# EAGLE design TheRug-Andabil (EAGLE 7.7.0)
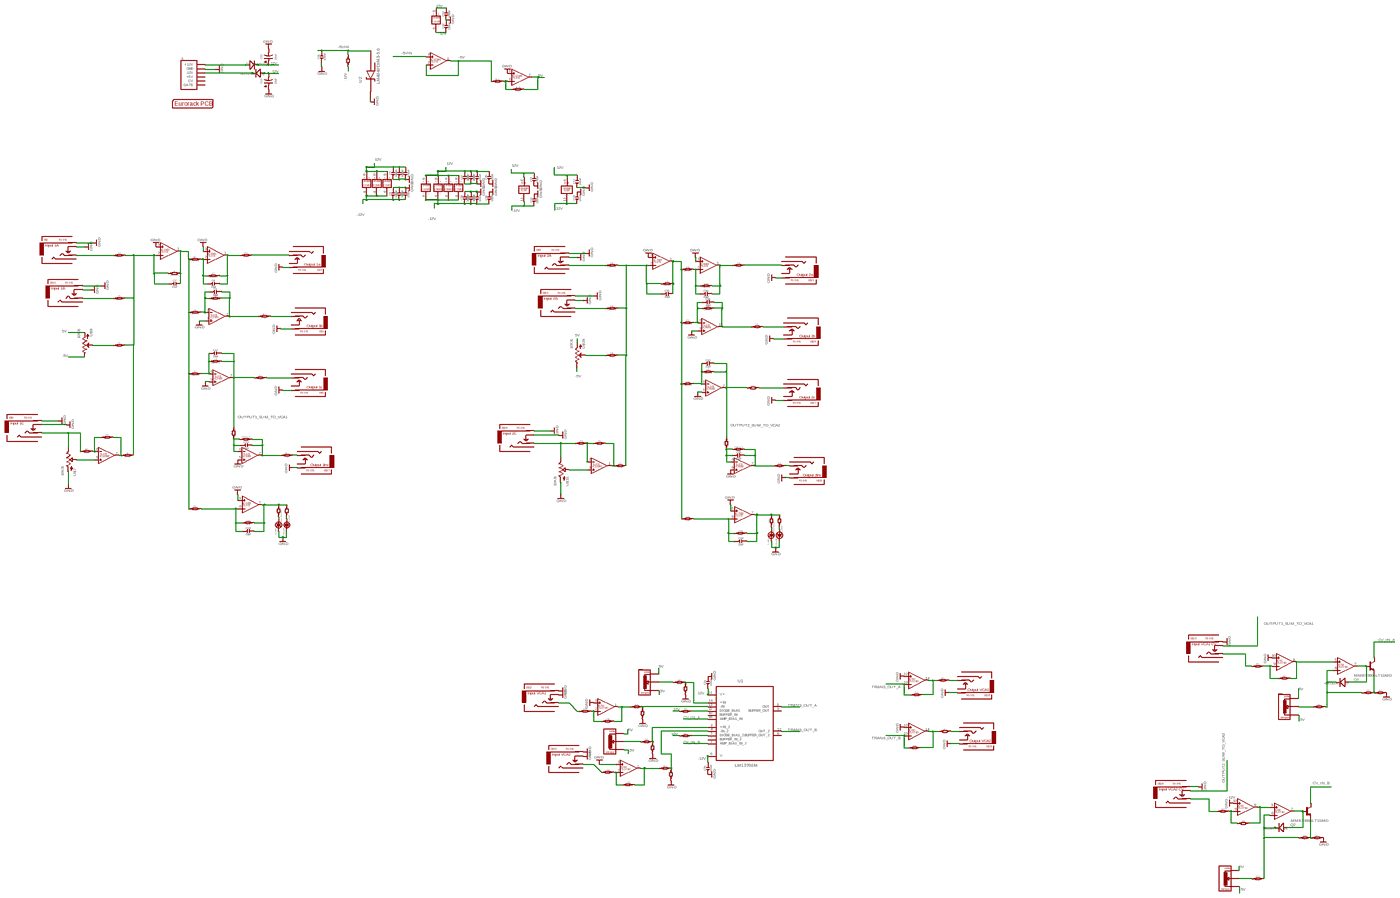
[diagram p0: schematic, sheet 1, overview]
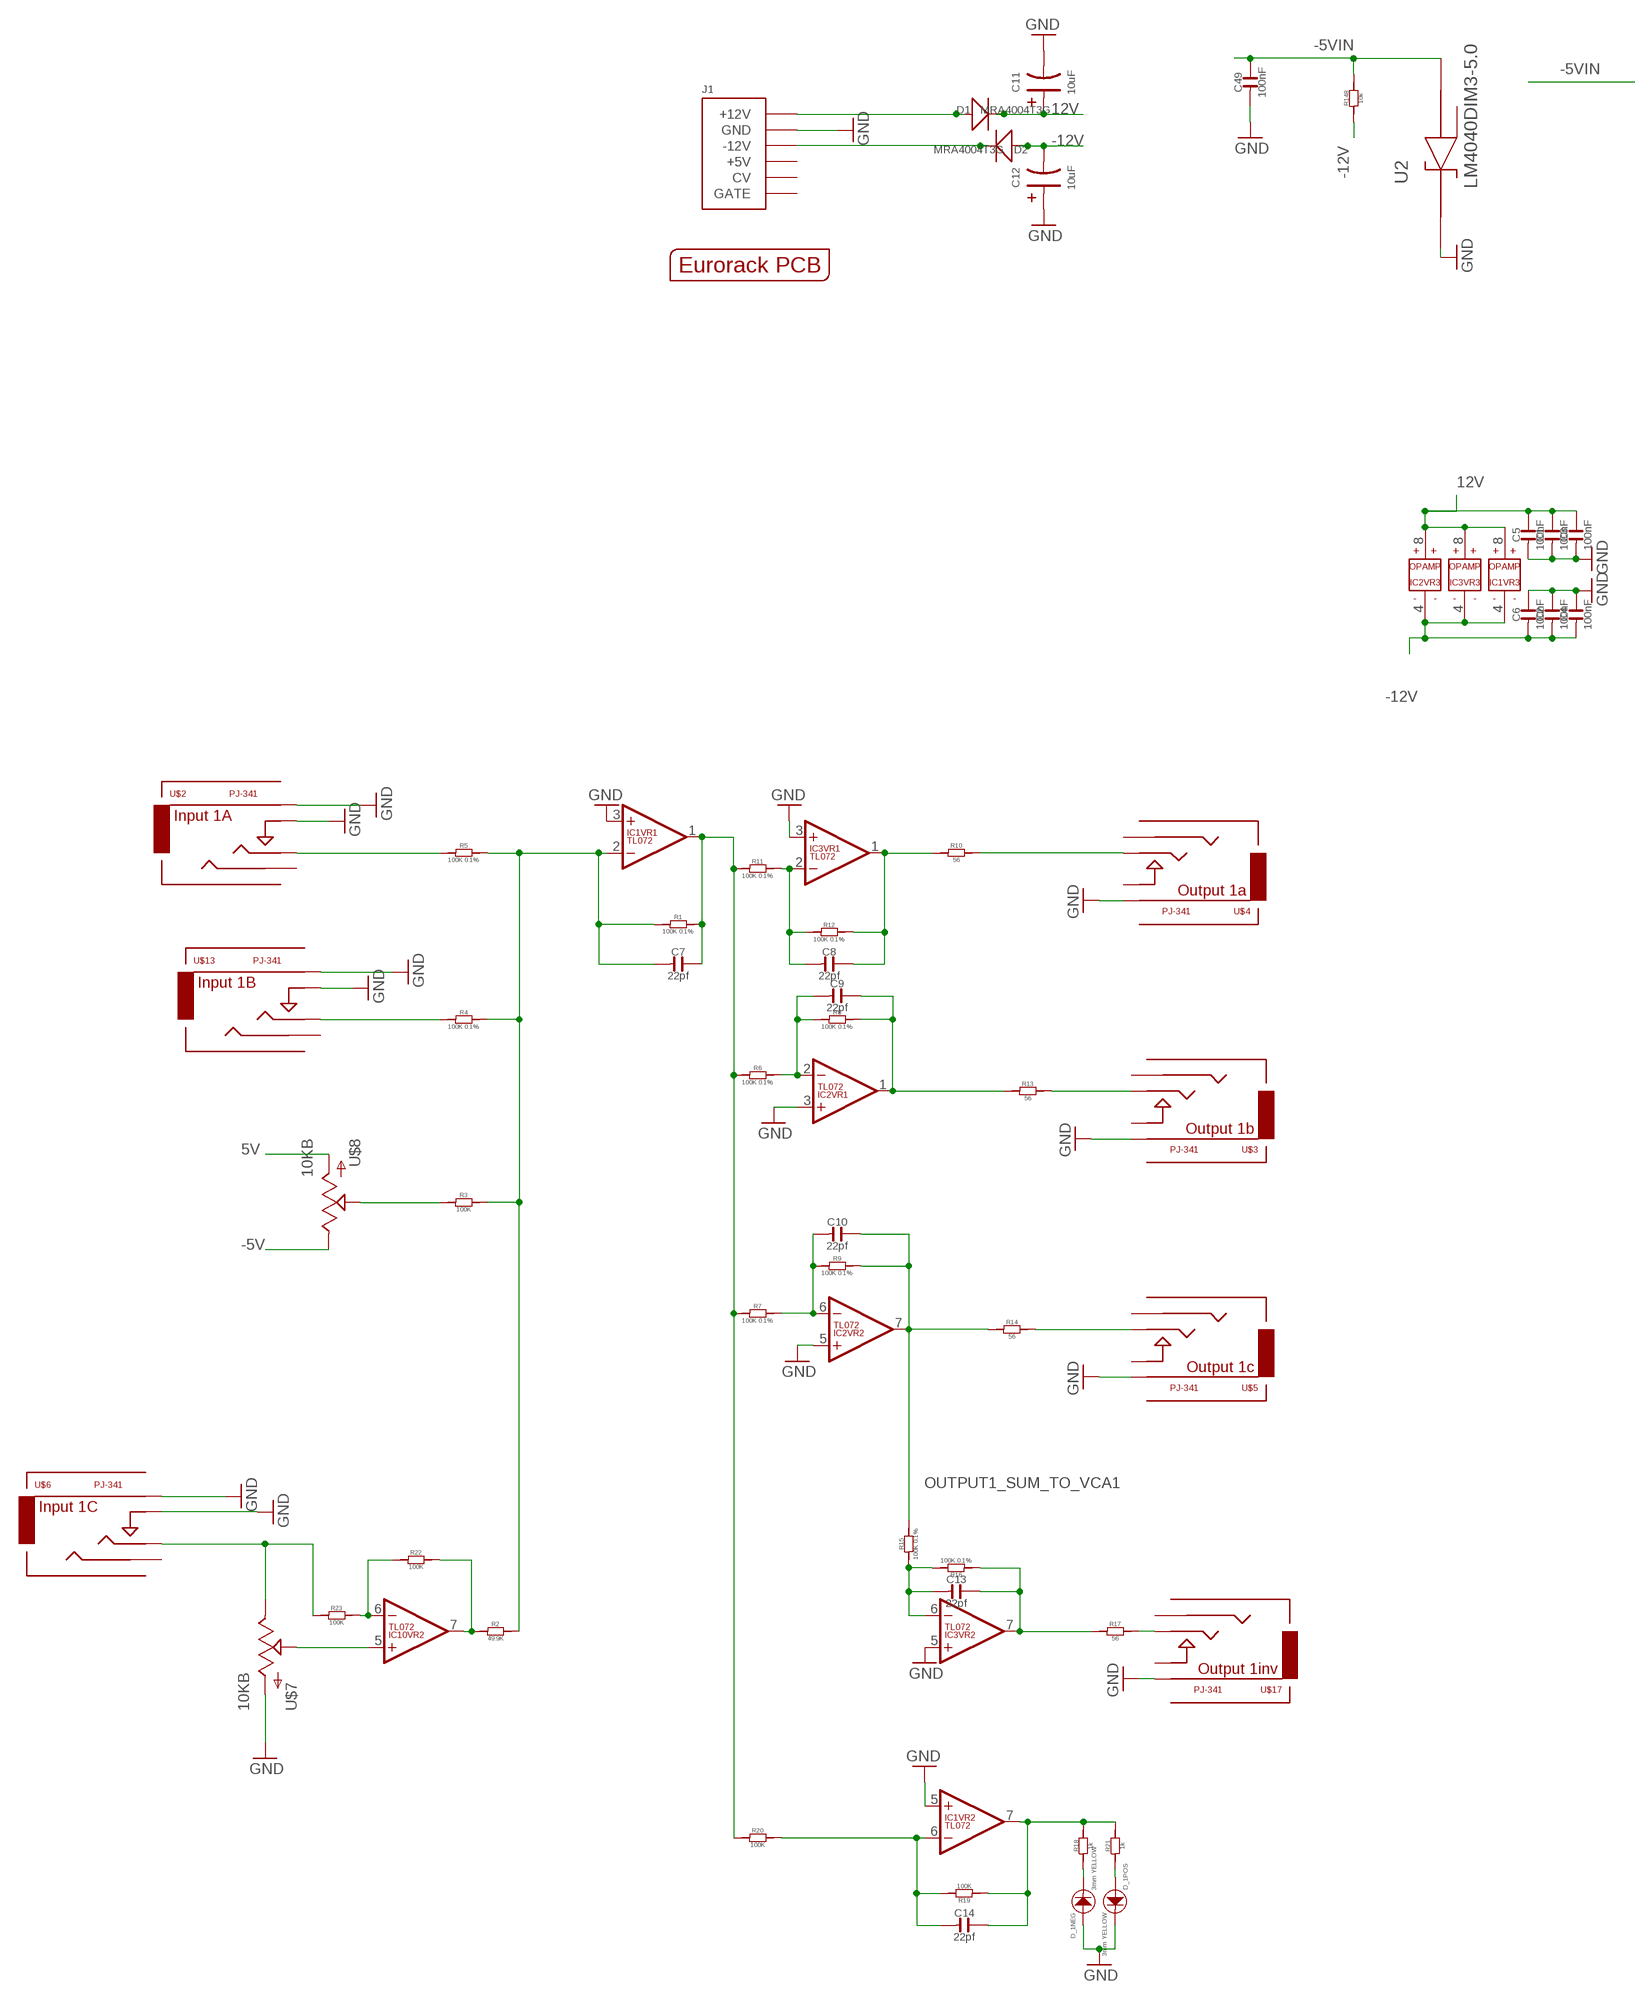
[diagram p1: schematic, sheet 1, part 1 of 4]
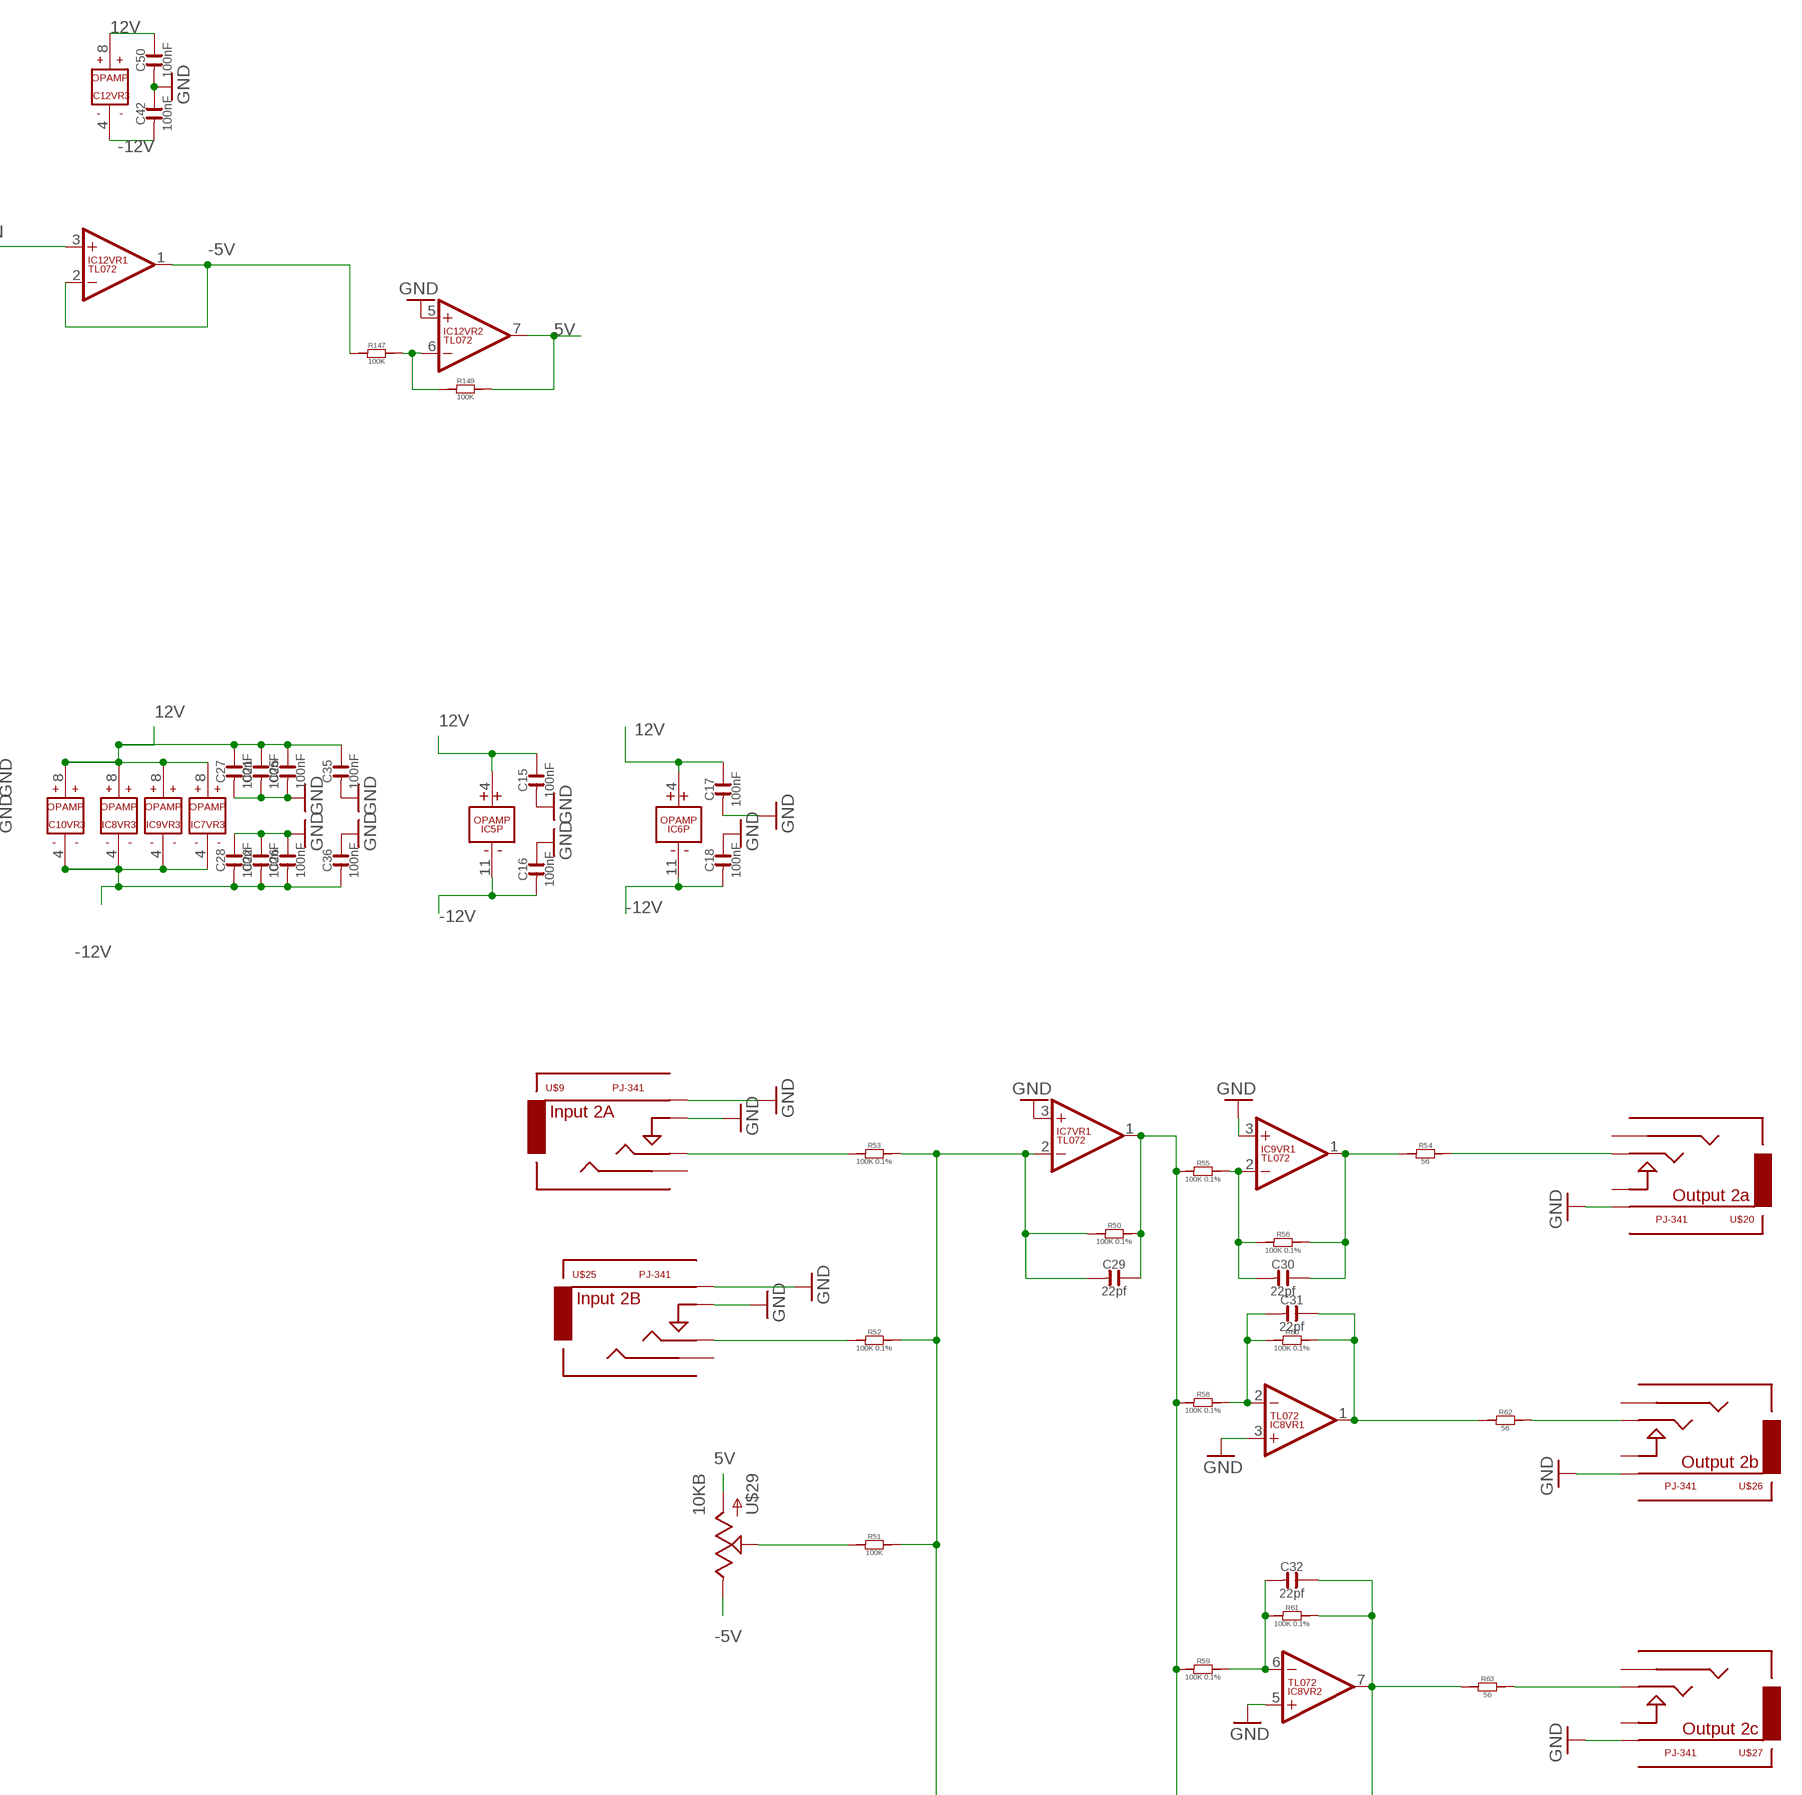
[diagram p2: schematic, sheet 1, part 2 of 4]
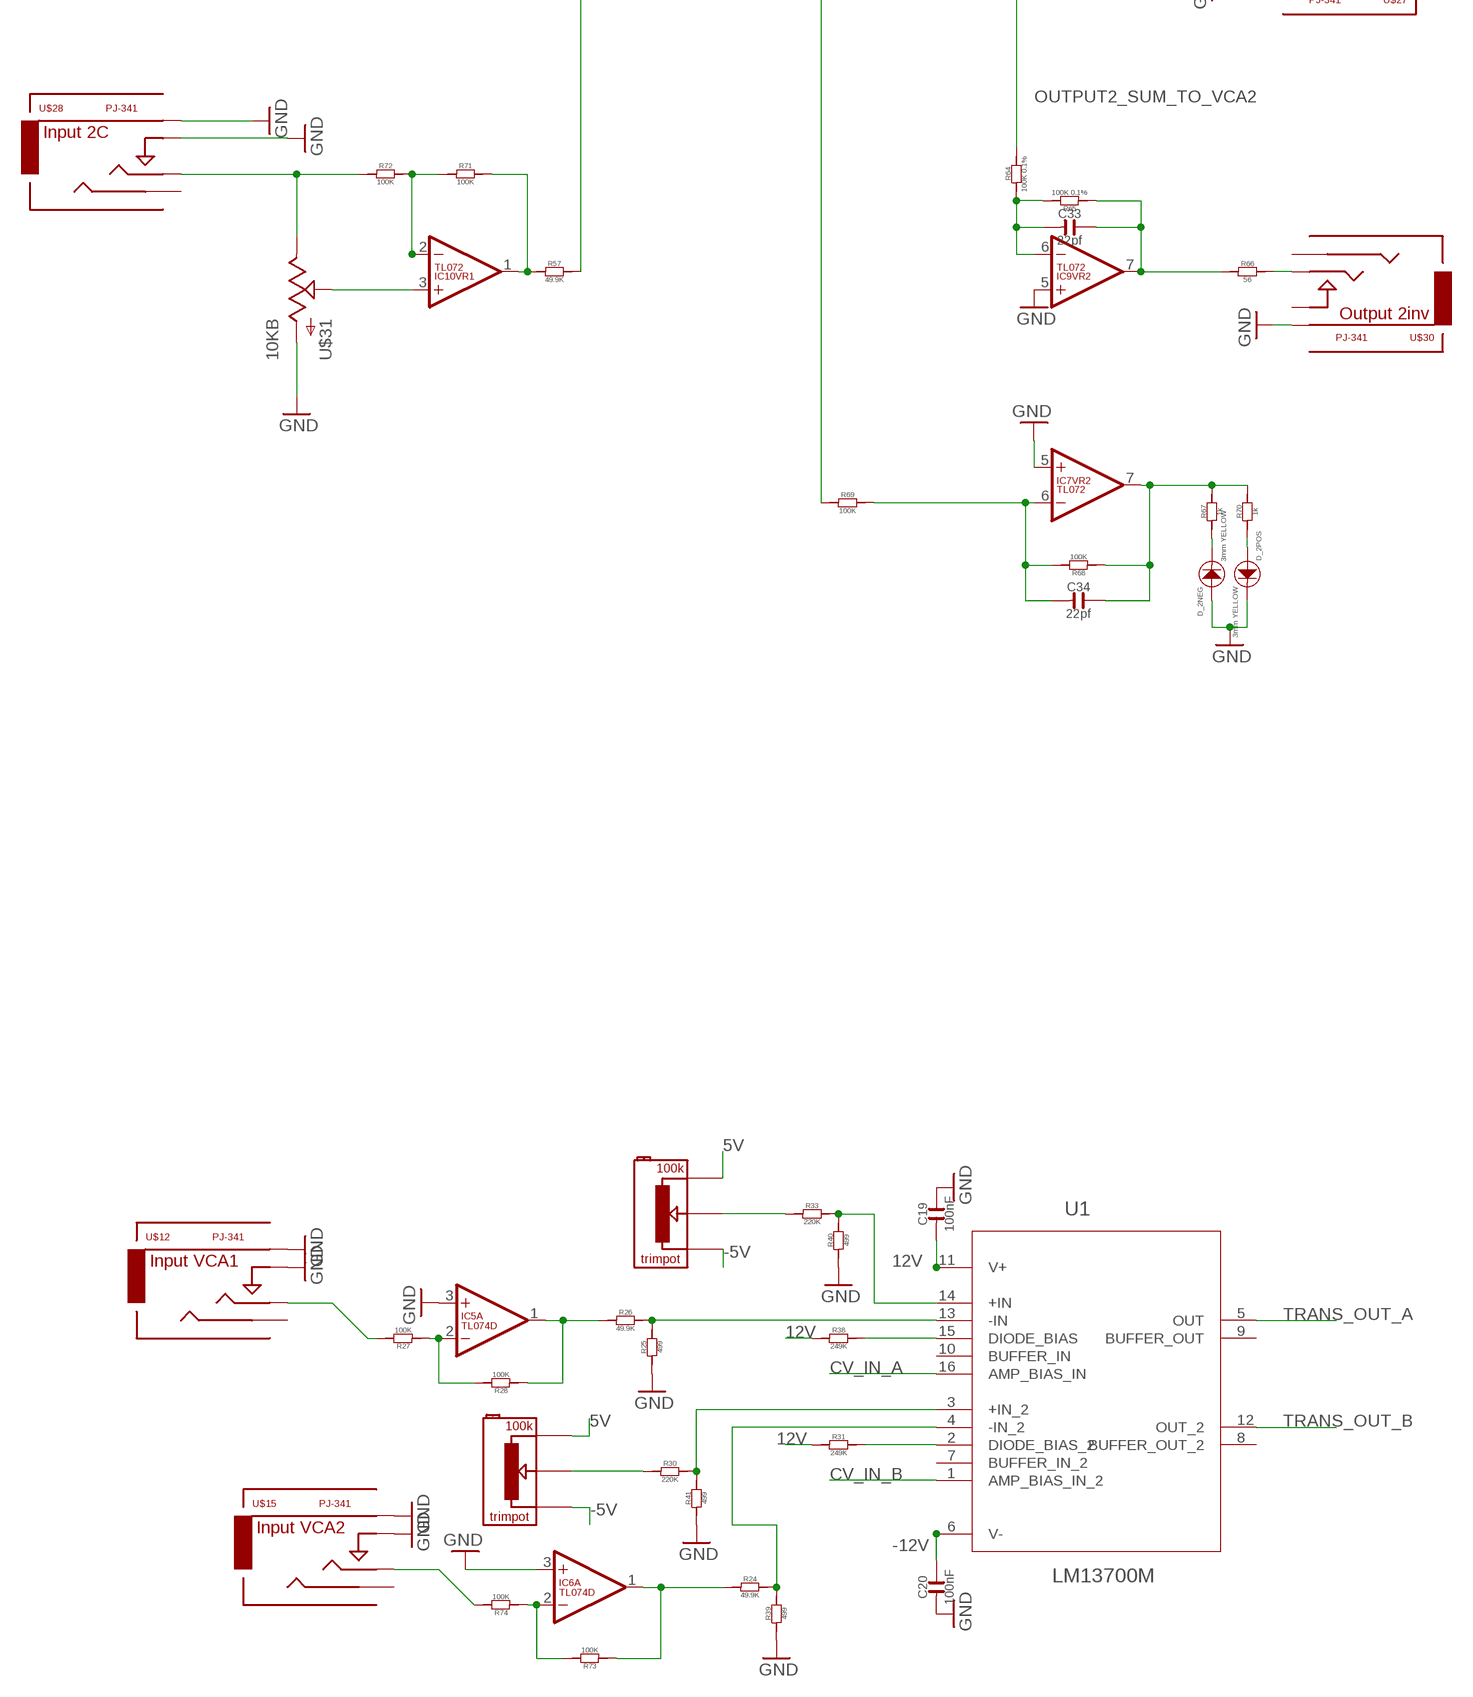
[diagram p3: schematic, sheet 1, part 3 of 4]
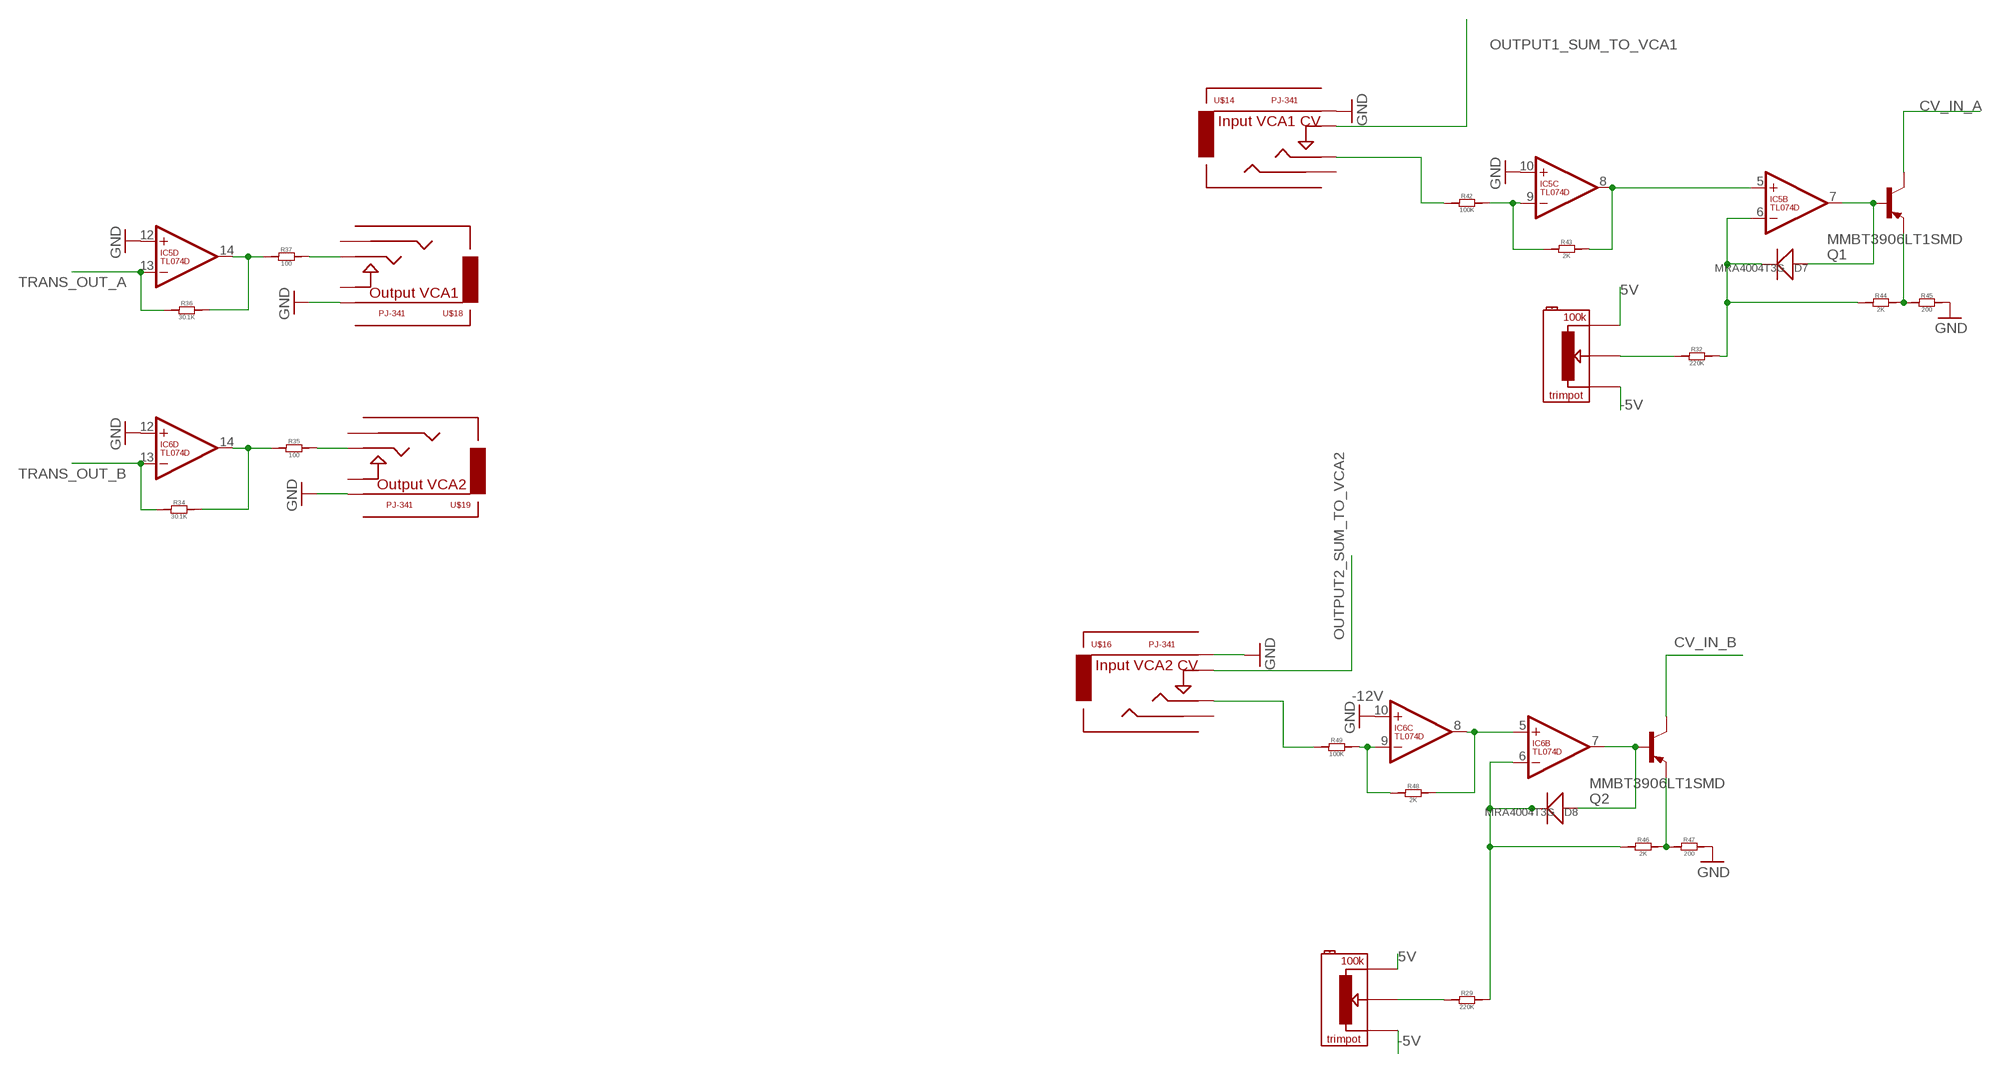
[diagram p4: schematic, sheet 1, part 4 of 4]

## Parts
C1  100nF  C-0603  [C0603]
C2  100nF  C-0603  [C0603]
C3  100nF  C-0603  [C0603]
C4  100nF  C-0603  [C0603]
C5  100nF  C-0603  [C0603]
C6  100nF  C-0603  [C0603]
C7  22pf  C-0603  [C0603]
C8  22pf  C-0603  [C0603]
C9  22pf  C-0603  [C0603]
C10  22pf  C-0603  [C0603]
C11  10uF  C-POLAR-A  [CASE-A_3216]
C12  10uF  C-POLAR-A  [CASE-A_3216]
C13  22pf  C-0603  [C0603]
C14  22pf  C-0603  [C0603]
C15  100nF  C-0603  [C0603]
C16  100nF  C-0603  [C0603]
C17  100nF  C-0603  [C0603]
C18  100nF  C-0603  [C0603]
C19  100nF  C-0603  [C0603]
C20  100nF  C-0603  [C0603]
C21  100nF  C-0603  [C0603]
C22  100nF  C-0603  [C0603]
C25  100nF  C-0603  [C0603]
C26  100nF  C-0603  [C0603]
C27  100nF  C-0603  [C0603]
C28  100nF  C-0603  [C0603]
C29  22pf  C-0603  [C0603]
C30  22pf  C-0603  [C0603]
C31  22pf  C-0603  [C0603]
C32  22pf  C-0603  [C0603]
C33  22pf  C-0603  [C0603]
C34  22pf  C-0603  [C0603]
C35  100nF  C-0603  [C0603]
C36  100nF  C-0603  [C0603]
C42  100nF  C-0603  [C0603]
C49  100nF  C-0603  [C0603]
C50  100nF  C-0603  [C0603]
D1  MRA4004T3G  D-SMA  [DO-214AC]
D2  MRA4004T3G  D-SMA  [DO-214AC]
D7  MRA4004T3G  D-SOD-123  [SOD123]
D8  MRA4004T3G  D-SOD-123  [SOD123]
D_1NEG  3mm YELLOW  LED3MM  [3MMLED]
D_1POS  3mm YELLOW  LED3MM  [3MMLED]
D_2NEG  3mm YELLOW  LED3MM  [3MMLED]
D_2POS  3mm YELLOW  LED3MM  [3MMLED]
IC1  TL072  [SO08]
IC2  TL072  [SO08]
IC3  TL072  [SO08]
IC5  TL074D  [SO14]
IC6  TL074D  [SO14]
IC7  TL072  [SO08]
IC8  TL072  [SO08]
IC9  TL072  [SO08]
IC10  TL072  [SO08]
IC12  TL072  [SO08]
J1  POWERSHROUDED  [POWER_16_SHROUDED]
Q1  MMBT3906LT1SMD  [SOT23-BEC]
Q2  MMBT3906LT1SMD  [SOT23-BEC]
R1  100K 0.1%  R-0603  [R0603]
R2  49.9K  R-0603  [R0603]
R3  100K  R-0603  [R0603]
R4  100K 0.1%  R-0603  [R0603]
R5  100K 0.1%  R-0603  [R0603]
R6  100K 0.1%  R-0603  [R0603]
R7  100K 0.1%  R-0603  [R0603]
R8  100K 0.1%  R-0603  [R0603]
R9  100K 0.1%  R-0603  [R0603]
R10  56  R-0603  [R0603]
R11  100K 0.1%  R-0603  [R0603]
R12  100K 0.1%  R-0603  [R0603]
R13  56  R-0603  [R0603]
R14  56  R-0603  [R0603]
R15  100K 0.1%  R-0603  [R0603]
R16  100K 0.1%  R-0603  [R0603]
R17  56  R-0603  [R0603]
R18  1k  R-0603  [R0603]
R19  100K  R-0603  [R0603]
R20  100K  R-0603  [R0603]
R21  1k  R-0603  [R0603]
R22  100K  R-0603  [R0603]
R23  100K  R-0603  [R0603]
R24  49.9K  R-0603  [R0603]
R25  499  R-0603  [R0603]
R26  49.9K  R-0603  [R0603]
R27  100K  R-0603  [R0603]
R28  100K  R-0603  [R0603]
R29  220K  R-0603  [R0603]
R30  220K  R-0603  [R0603]
R31  249K  R-0603  [R0603]
R32  220K  R-0603  [R0603]
R33  220K  R-0603  [R0603]
R34  30.1K  R-0603  [R0603]
R35  100  R-0603  [R0603]
R36  30.1K  R-0603  [R0603]
R37  100  R-0603  [R0603]
R38  249K  R-0603  [R0603]
R39  499  R-0603  [R0603]
R40  499  R-0603  [R0603]
R41  499  R-0603  [R0603]
R42  100K  R-0603  [R0603]
R43  2K  R-0603  [R0603]
R44  2K  R-0603  [R0603]
R45  200  R-0603  [R0603]
R46  2K  R-0603  [R0603]
R47  200  R-0603  [R0603]
R48  2K  R-0603  [R0603]
R49  100K  R-0603  [R0603]
R50  100K 0.1%  R-0603  [R0603]
R51  100K  R-0603  [R0603]
R52  100K 0.1%  R-0603  [R0603]
R53  100K 0.1%  R-0603  [R0603]
R54  56  R-0603  [R0603]
R55  100K 0.1%  R-0603  [R0603]
R56  100K 0.1%  R-0603  [R0603]
R57  49.9K  R-0603  [R0603]
R58  100K 0.1%  R-0603  [R0603]
R59  100K 0.1%  R-0603  [R0603]
R60  100K 0.1%  R-0603  [R0603]
R61  100K 0.1%  R-0603  [R0603]
R62  56  R-0603  [R0603]
R63  56  R-0603  [R0603]
R64  100K 0.1%  R-0603  [R0603]
R65  100K 0.1%  R-0603  [R0603]
R66  56  R-0603  [R0603]
R67  1k  R-0603  [R0603]
R68  100K  R-0603  [R0603]
R69  100K  R-0603  [R0603]
R70  1k  R-0603  [R0603]
R71  100K  R-0603  [R0603]
R72  100K  R-0603  [R0603]
R73  100K  R-0603  [R0603]
R74  100K  R-0603  [R0603]
R75  100k  TRIMPOT  [TRIMPOT]
R76  100k  TRIMPOT  [TRIMPOT]
R77  100k  TRIMPOT  [TRIMPOT]
R78  100k  TRIMPOT  [TRIMPOT]
R147  100K  R-0603  [R0603]
R148  10k  R-0603  [R0603]
R149  100K  R-0603  [R0603]
U1  LM13700M  [SOIC127P620X175-16N]
U2  LM4040DIM3-5.0  [SOT95P237X112-3N]
U$1  EURORACK_PCB12HP  [EURORACK12HPPCB]
U$2  PJ-341  AUDIO-JACKINPUT  [3.5MM-JACK-SWITCH-13MM-INPUT]
U$3  PJ-341  AUDIO-JACKOUTPUT  [3.5MM-JACK-SWITCH-13MM-OUTPUT]
U$4  PJ-341  AUDIO-JACKOUTPUT  [3.5MM-JACK-SWITCH-13MM-OUTPUT]
U$5  PJ-341  AUDIO-JACKOUTPUT  [3.5MM-JACK-SWITCH-13MM-OUTPUT]
U$6  PJ-341  AUDIO-JACKINPUT  [3.5MM-JACK-SWITCH-13MM-INPUT]
U$7  10KB  POTSQUAREHOLE_SMALLKNOB  [ALPS_POT_SQUAREHOLES]
U$8  10KB  POTSQUAREHOLE_SMALLKNOB  [ALPS_POT_SQUAREHOLES]
U$9  PJ-341  AUDIO-JACKINPUT  [3.5MM-JACK-SWITCH-13MM-INPUT]
U$12  PJ-341  AUDIO-JACKINPUT  [3.5MM-JACK-SWITCH-13MM-INPUT]
U$13  PJ-341  AUDIO-JACKINPUT  [3.5MM-JACK-SWITCH-13MM-INPUT]
U$14  PJ-341  AUDIO-JACKINPUT  [3.5MM-JACK-SWITCH-13MM-INPUT]
U$15  PJ-341  AUDIO-JACKINPUT  [3.5MM-JACK-SWITCH-13MM-INPUT]
U$16  PJ-341  AUDIO-JACKINPUT  [3.5MM-JACK-SWITCH-13MM-INPUT]
U$17  PJ-341  AUDIO-JACKOUTPUT  [3.5MM-JACK-SWITCH-13MM-OUTPUT]
U$18  PJ-341  AUDIO-JACKOUTPUT  [3.5MM-JACK-SWITCH-13MM-OUTPUT]
U$19  PJ-341  AUDIO-JACKOUTPUT  [3.5MM-JACK-SWITCH-13MM-OUTPUT]
U$20  PJ-341  AUDIO-JACKOUTPUT  [3.5MM-JACK-SWITCH-13MM-OUTPUT]
U$25  PJ-341  AUDIO-JACKINPUT  [3.5MM-JACK-SWITCH-13MM-INPUT]
U$26  PJ-341  AUDIO-JACKOUTPUT  [3.5MM-JACK-SWITCH-13MM-OUTPUT]
U$27  PJ-341  AUDIO-JACKOUTPUT  [3.5MM-JACK-SWITCH-13MM-OUTPUT]
U$28  PJ-341  AUDIO-JACKINPUT  [3.5MM-JACK-SWITCH-13MM-INPUT]
U$29  10KB  POTSQUAREHOLE_SMALLKNOB  [ALPS_POT_SQUAREHOLES]
U$30  PJ-341  AUDIO-JACKOUTPUT  [3.5MM-JACK-SWITCH-13MM-OUTPUT]
U$31  10KB  POTSQUAREHOLE_SMALLKNOB  [ALPS_POT_SQUAREHOLES]

## Nets
5V [heavypower]: IC12.7(VR2:OUT) R75.P$3 R76.P$3 R77.P$3 R78.P$3 R149.2 U$8.P$3(A) U$29.P$3(A)
12V [heavypower]: C1.2 C3.2 C5.2 C11.+ C15.2 C17.2 C19.1 C21.2 C25.2 C27.2 C35.2 C50.2 D1.2(-) IC1.8(VR3:V+) IC2.8(VR3:V+) IC3.8(VR3:V+) IC5.4(P:V+) IC6.4(P:V+) IC7.8(VR3:V+) IC8.8(VR3:V+) IC9.8(VR3:V+) IC10.8(VR3:V+) IC12.8(VR3:V+) R31.1 R38.1 U1.11(V+)
-5V [heavypower]: IC12.1(VR1:OUT) IC12.2(VR1:-IN) R75.P$1 R76.P$1 R77.P$1 R78.P$1 R147.1 U$8.P$1(E) U$29.P$1(E)
-5V_TO_5V: IC12.6(VR2:-IN) R147.2 R149.1
-5VIN [heavypower]: C49.2 IC12.3(VR1:+IN) R148.2 U2.2(ANODE)
-12V [heavypower]: C2.1 C4.1 C6.1 C12.- C16.1 C18.1 C20.2 C22.1 C26.1 C28.1 C36.1 C42.1 D2.1(+) IC1.4(VR3:V-) IC2.4(VR3:V-) IC3.4(VR3:V-) IC5.11(P:V-) IC6.11(P:V-) IC7.4(VR3:V-) IC8.4(VR3:V-) IC9.4(VR3:V-) IC10.4(VR3:V-) IC12.4(VR3:V-) R148.1 U1.6(V-)
CV_IN_A: Q1.C U1.16(AMP_BIAS_IN)
CV_IN_B: Q2.C U1.1(AMP_BIAS_IN_2)
GND: C1.1 C2.2 C3.1 C4.2 C5.1 C6.2 C11.- C12.+ C15.1 C16.2 C17.1 C18.2 C19.2 C20.1 C21.1 C22.2 C25.1 C26.2 C27.1 C28.2 C35.1 C36.2 C42.2 C49.1 C50.1 D_1NEG.+ D_1POS.- D_2NEG.+ D_2POS.- IC1.3(VR1:+IN) IC1.5(VR2:+IN) IC2.3(VR1:+IN) IC2.5(VR2:+IN) IC3.3(VR1:+IN) IC3.5(VR2:+IN) IC5.3(A:+IN) IC5.10(C:+IN) IC5.12(D:+IN) IC6.3(A:+IN) IC6.10(C:+IN) IC6.12(D:+IN) IC7.3(VR1:+IN) IC7.5(VR2:+IN) IC8.3(VR1:+IN) IC8.5(VR2:+IN) IC9.3(VR1:+IN) IC9.5(VR2:+IN) IC12.5(VR2:+IN) J1.3(GND) J1.4(GND) J1.5(GND) J1.6(GND) J1.7(GND) J1.8(GND) R25.1 R39.1 R40.1 R41.1 R45.2 R47.2 U2.1(CATHODE) U$2.RING@3(RING) U$2.SWITCH@3(SWITCH) U$3.RING@3(RING) U$4.RING@3(RING) U$5.RING@3(RING) U$6.RING@3(RING) U$6.SWITCH@3(SWITCH) U$7.P$3(A) U$9.RING@3(RING) U$9.SWITCH@3(SWITCH) U$12.RING@3(RING) U$12.SWITCH@3(SWITCH) U$13.RING@3(RING) U$13.SWITCH@3(SWITCH) U$14.RING@3(RING) U$15.RING@3(RING) U$15.SWITCH@3(SWITCH) U$16.RING@3(RING) U$17.RING@3(RING) U$18.RING@3(RING) U$19.RING@3(RING) U$20.RING@3(RING) U$25.RING@3(RING) U$25.SWITCH@3(SWITCH) U$26.RING@3(RING) U$27.RING@3(RING) U$28.RING@3(RING) U$28.SWITCH@3(SWITCH) U$30.RING@3(RING) U$31.P$3(A)
N$1: IC10.5(VR2:+IN) U$7.P$2(S)
N$2: C8.2 IC3.1(VR1:OUT) R10.1 R12.2
N$3: IC10.7(VR2:OUT) R2.1 R22.2
N$4: R23.1 U$6.TIP@3(TIP) U$7.P$1(E)
N$5: C9.1 IC2.2(VR1:-IN) R6.2 R8.1
N$6: R3.1 U$8.P$2(S)
N$7: C7.2 IC1.1(VR1:OUT) R1.2 R6.1 R7.1 R11.1 R20.1
N$8: C8.1 IC3.2(VR1:-IN) R11.2 R12.1
N$9: C10.1 IC2.6(VR2:-IN) R7.2 R9.1
N$10: IC10.6(VR2:-IN) R22.1 R23.2
N$11: C9.2 IC2.1(VR1:OUT) R8.2 R13.1
N$12: R4.1 U$13.TIP@3(TIP)
N$13: IC6.1(A:OUT) R24.1 R73.1
N$14: C7.1 IC1.2(VR1:-IN) R1.1 R2.2 R3.2 R4.2 R5.2
N$15: R13.2 U$3.TIP@3(TIP)
N$16: R14.2 U$5.TIP@3(TIP)
N$17: C13.1 IC3.6(VR2:-IN) R15.1 R16.2
N$18: C13.2 IC3.7(VR2:OUT) R16.1 R17.1
N$19: R17.2 U$17.TIP@3(TIP)
N$20: R5.1 U$2.TIP@3(TIP)
N$21: D_1POS.+ R21.1
N$22: R10.2 U$4.TIP@3(TIP)
N$23: D_1NEG.- R18.1
N$24: C14.2 IC1.7(VR2:OUT) R18.2 R19.1 R21.2
N$25: C14.1 IC1.6(VR2:-IN) R19.2 R20.2
N$26: R37.2 U$18.TIP@3(TIP)
N$27: IC5.14(D:OUT) R36.2 R37.1
N$28 [heavypower]: D1.1(+) J1.9(+12V) J1.10(+12V)
N$29: R31.2 U1.2(DIODE_BIAS_2)
N$30: R38.2 U1.15(DIODE_BIAS)
N$31: R35.2 U$19.TIP@3(TIP)
N$32: IC6.14(D:OUT) R34.2 R35.1
N$33: R33.1 R75.P$2
N$34: R32.1 R77.P$2
N$35: R30.1 R76.P$2
N$36: R29.1 R78.P$2
N$37: R27.2 U$12.TIP@3(TIP)
N$38: R74.2 U$15.TIP@3(TIP)
N$39: IC5.2(A:-IN) R27.1 R28.2
N$41: IC5.1(A:OUT) R26.1 R28.1
N$43: R25.2 R26.2 U1.13(-IN)
N$44: R24.2 R39.2 U1.4(-IN_2)
N$45: R33.2 R40.2 U1.14(+IN)
N$46: R30.2 R41.2 U1.3(+IN_2)
N$47: R49.1 U$16.TIP@3(TIP)
N$48: R42.1 U$14.TIP@3(TIP)
N$49: IC6.2(A:-IN) R73.2 R74.1
N$50: IC5.9(C:-IN) R42.2 R43.1
N$51: IC5.5(B:+IN) IC5.8(C:OUT) R43.2
N$52: D7.- IC5.6(B:-IN) R32.2 R44.1
N$53: C30.2 IC9.1(VR1:OUT) R54.1 R56.2
N$54: R51.1 U$29.P$2(S)
N$55: D7.+ IC5.7(B:OUT) Q1.B
N$56: Q1.E R44.2 R45.1
N$57: D8.- IC6.6(B:-IN) R29.2 R46.1
N$58: D8.+ IC6.7(B:OUT) Q2.B
N$59: Q2.E R46.2 R47.1
N$60: IC6.5(B:+IN) IC6.8(C:OUT) R48.2
N$62: IC6.9(C:-IN) R48.1 R49.2
N$63: R52.1 U$25.TIP@3(TIP)
N$64 [heavypower]: D2.2(-) J1.1(-12V) J1.2(-12V)
N$65: C29.1 IC7.2(VR1:-IN) R50.1 R51.2 R52.2 R53.2 R57.2
N$66: R54.2 U$20.TIP@3(TIP)
N$67: C29.2 IC7.1(VR1:OUT) R50.2 R55.1 R58.1 R59.1 R69.1
N$68: C30.1 IC9.2(VR1:-IN) R55.2 R56.1
N$69: R53.1 U$9.TIP@3(TIP)
N$70: R72.1 U$28.TIP@3(TIP) U$31.P$1(E)
N$71: C31.1 IC8.2(VR1:-IN) R58.2 R60.1
N$72: C32.1 IC8.6(VR2:-IN) R59.2 R61.1
N$73: C31.2 IC8.1(VR1:OUT) R60.2 R62.1
N$75: R62.2 U$26.TIP@3(TIP)
N$76: R63.2 U$27.TIP@3(TIP)
N$77: C33.1 IC9.6(VR2:-IN) R64.1 R65.2
N$78: C33.2 IC9.7(VR2:OUT) R65.1 R66.1
N$79: R66.2 U$30.TIP@3(TIP)
N$80: D_2NEG.- R67.1
N$81: C34.2 IC7.7(VR2:OUT) R67.2 R68.1 R70.2
N$82: C34.1 IC7.6(VR2:-IN) R68.2 R69.2
N$83: D_2POS.+ R70.1
N$84: IC10.3(VR1:+IN) U$31.P$2(S)
N$85: IC10.1(VR1:OUT) R57.1 R71.2
N$86: IC10.2(VR1:-IN) R71.1 R72.2
OUTPUT1_SUM_TO_VCA1: C10.2 IC2.7(VR2:OUT) R9.2 R14.1 R15.2 U$14.SWITCH@3(SWITCH)
OUTPUT2_SUM_TO_VCA2: C32.2 IC8.7(VR2:OUT) R61.2 R63.1 R64.2 U$16.SWITCH@3(SWITCH)
TRANS_OUT_A: IC5.13(D:-IN) R36.1 U1.5(OUT)
TRANS_OUT_B: IC6.13(D:-IN) R34.1 U1.12(OUT_2)
Unconnected: J1.11(+5V) J1.12(+5V) J1.13(CV) J1.14(CV) J1.15(GATE) J1.16(GATE) U1.7(BUFFER_IN_2) U1.8(BUFFER_OUT_2) U1.9(BUFFER_OUT) U1.10(BUFFER_IN) U2.3(NC) U$2.SECOND@3(SECOND) U$3.SECOND@3(SECOND) U$3.SWITCH@3(SWITCH) U$4.SECOND@3(SECOND) U$4.SWITCH@3(SWITCH) U$5.SECOND@3(SECOND) U$5.SWITCH@3(SWITCH) U$6.SECOND@3(SECOND) U$9.SECOND@3(SECOND) U$12.SECOND@3(SECOND) U$13.SECOND@3(SECOND) U$14.SECOND@3(SECOND) U$15.SECOND@3(SECOND) U$16.SECOND@3(SECOND) U$17.SECOND@3(SECOND) U$17.SWITCH@3(SWITCH) U$18.SECOND@3(SECOND) U$18.SWITCH@3(SWITCH) U$19.SECOND@3(SECOND) U$19.SWITCH@3(SWITCH) U$20.SECOND@3(SECOND) U$20.SWITCH@3(SWITCH) U$25.SECOND@3(SECOND) U$26.SECOND@3(SECOND) U$26.SWITCH@3(SWITCH) U$27.SECOND@3(SECOND) U$27.SWITCH@3(SWITCH) U$28.SECOND@3(SECOND) U$30.SECOND@3(SECOND) U$30.SWITCH@3(SWITCH)

## Library data of the parts
C1-C10 C13-C22 C25-C36 C42 C50 = OPL:C*
C11 C12 = EurorackModularParts:C-POLAR*
C49 = OPL:C*; MF: AVX; MPN: 06035C104KAT2A; OC_FARNELL: 1301804
D1 D2 D7 D8 = OPL:D*: DIODE; MF: VISHAY; MPN: US1G-E3/5AT; OC_FARNELL: 9551824
D_1NEG D_1POS D_2NEG D_2POS = EurorackModularParts:LED*: LED
IC1-IC3 IC7-IC10 IC12 = EurorackModularParts:TL072
IC5 IC6 = EurorackModularParts:TL074: OP AMP
J1 = EurorackModularParts:POWER
Q1 Q2 = transistor-pnp:MMBT3906*: PNP Transistror
R1-R74 R147 R149 = OPL:R*
R75 = EurorackModularParts:TRIMPOT; DESC: VCA1 BIAS
R76 = EurorackModularParts:TRIMPOT; DESC: VCA2 BIAS
R77 = EurorackModularParts:TRIMPOT; DESC: VCA1 CV BIAS
R78 = EurorackModularParts:TRIMPOT; DESC: VCA2 CV BIAS
R148 = OPL:R*; OC_FARNELL: unknown
U1 = FarnellThings:LM13700M: Dual Operational Transconductance Amplifiers; MPN: LM13700M; OC_FARNELL: 1468910; OC_NEWARK: 41K3505; PACKAGE: SOIC-16; SUPPLIER: National Semiconductor
U2 = FarnellThings:LM4040DIM3-5.0: IC, Precision Micropower Shunt Voltage Reference, 5V,SOT-23-3; MF: TEXAS INSTRUMENTS; MPN: LM4040DIM3-5.0; OC_FARNELL: 9778330; OC_NEWARK: 97K3489; PACKAGE: SOT-23-3; SUPPLIER: TEXAS INSTRUMENTS
U$1 = EurorackModularParts:EURORACK_PCB
U$2 = EurorackModularParts:AUDIO-JACK: Switching Mono 3.5mm Audio Jack from Erthenvar.; DESC: Input 1A; MPN: PJ-341
U$3 = EurorackModularParts:AUDIO-JACK: Switching Mono 3.5mm Audio Jack from Erthenvar.; DESC: Output 1b; MPN: PJ-341
U$4 = EurorackModularParts:AUDIO-JACK: Switching Mono 3.5mm Audio Jack from Erthenvar.; DESC: Output 1a; MPN: PJ-341
U$5 = EurorackModularParts:AUDIO-JACK: Switching Mono 3.5mm Audio Jack from Erthenvar.; DESC: Output 1c; MPN: PJ-341
U$6 = EurorackModularParts:AUDIO-JACK: Switching Mono 3.5mm Audio Jack from Erthenvar.; DESC: Input 1C; MPN: PJ-341
U$7 U$8 U$29 U$31 = EurorackModularParts:POT
U$9 = EurorackModularParts:AUDIO-JACK: Switching Mono 3.5mm Audio Jack from Erthenvar.; DESC: Input 2A; MPN: PJ-341
U$12 = EurorackModularParts:AUDIO-JACK: Switching Mono 3.5mm Audio Jack from Erthenvar.; DESC: Input VCA1; MPN: PJ-341
U$13 = EurorackModularParts:AUDIO-JACK: Switching Mono 3.5mm Audio Jack from Erthenvar.; DESC: Input 1B; MPN: PJ-341
U$14 = EurorackModularParts:AUDIO-JACK: Switching Mono 3.5mm Audio Jack from Erthenvar.; DESC: Input VCA1 CV; MPN: PJ-341
U$15 = EurorackModularParts:AUDIO-JACK: Switching Mono 3.5mm Audio Jack from Erthenvar.; DESC: Input VCA2; MPN: PJ-341
U$16 = EurorackModularParts:AUDIO-JACK: Switching Mono 3.5mm Audio Jack from Erthenvar.; DESC: Input VCA2 CV; MPN: PJ-341
U$17 = EurorackModularParts:AUDIO-JACK: Switching Mono 3.5mm Audio Jack from Erthenvar.; DESC: Output 1inv; MPN: PJ-341
U$18 = EurorackModularParts:AUDIO-JACK: Switching Mono 3.5mm Audio Jack from Erthenvar.; DESC: Output VCA1; MPN: PJ-341
U$19 = EurorackModularParts:AUDIO-JACK: Switching Mono 3.5mm Audio Jack from Erthenvar.; DESC: Output VCA2; MPN: PJ-341
U$20 = EurorackModularParts:AUDIO-JACK: Switching Mono 3.5mm Audio Jack from Erthenvar.; DESC: Output 2a; MPN: PJ-341
U$25 = EurorackModularParts:AUDIO-JACK: Switching Mono 3.5mm Audio Jack from Erthenvar.; DESC: Input 2B; MPN: PJ-341
U$26 = EurorackModularParts:AUDIO-JACK: Switching Mono 3.5mm Audio Jack from Erthenvar.; DESC: Output 2b; MPN: PJ-341
U$27 = EurorackModularParts:AUDIO-JACK: Switching Mono 3.5mm Audio Jack from Erthenvar.; DESC: Output 2c; MPN: PJ-341
U$28 = EurorackModularParts:AUDIO-JACK: Switching Mono 3.5mm Audio Jack from Erthenvar.; DESC: Input 2C; MPN: PJ-341
U$30 = EurorackModularParts:AUDIO-JACK: Switching Mono 3.5mm Audio Jack from Erthenvar.; DESC: Output 2inv; MPN: PJ-341

## Net classes
0 default: width 0.254 mm
1 heavypower: width 0.381 mm

## Board
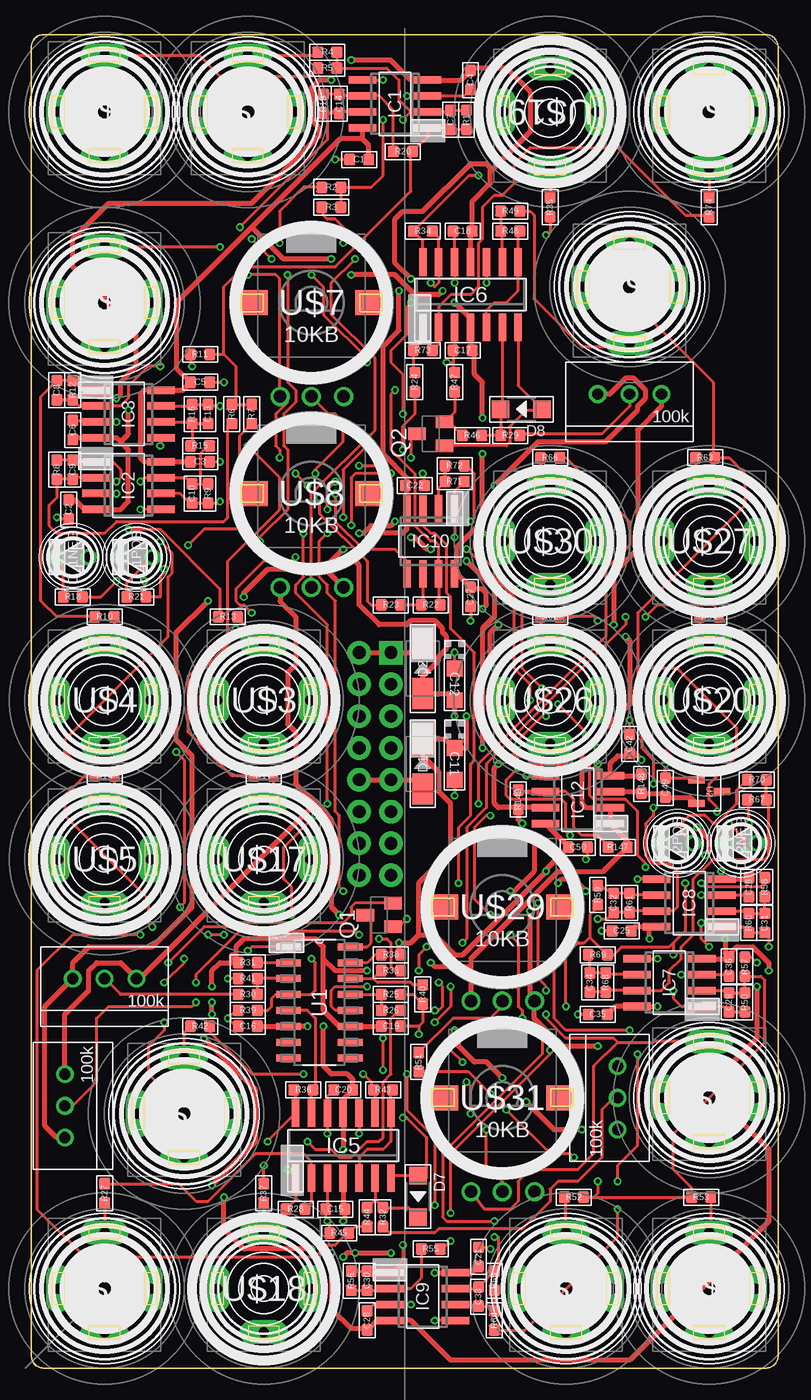
[diagram p5: board, top side]
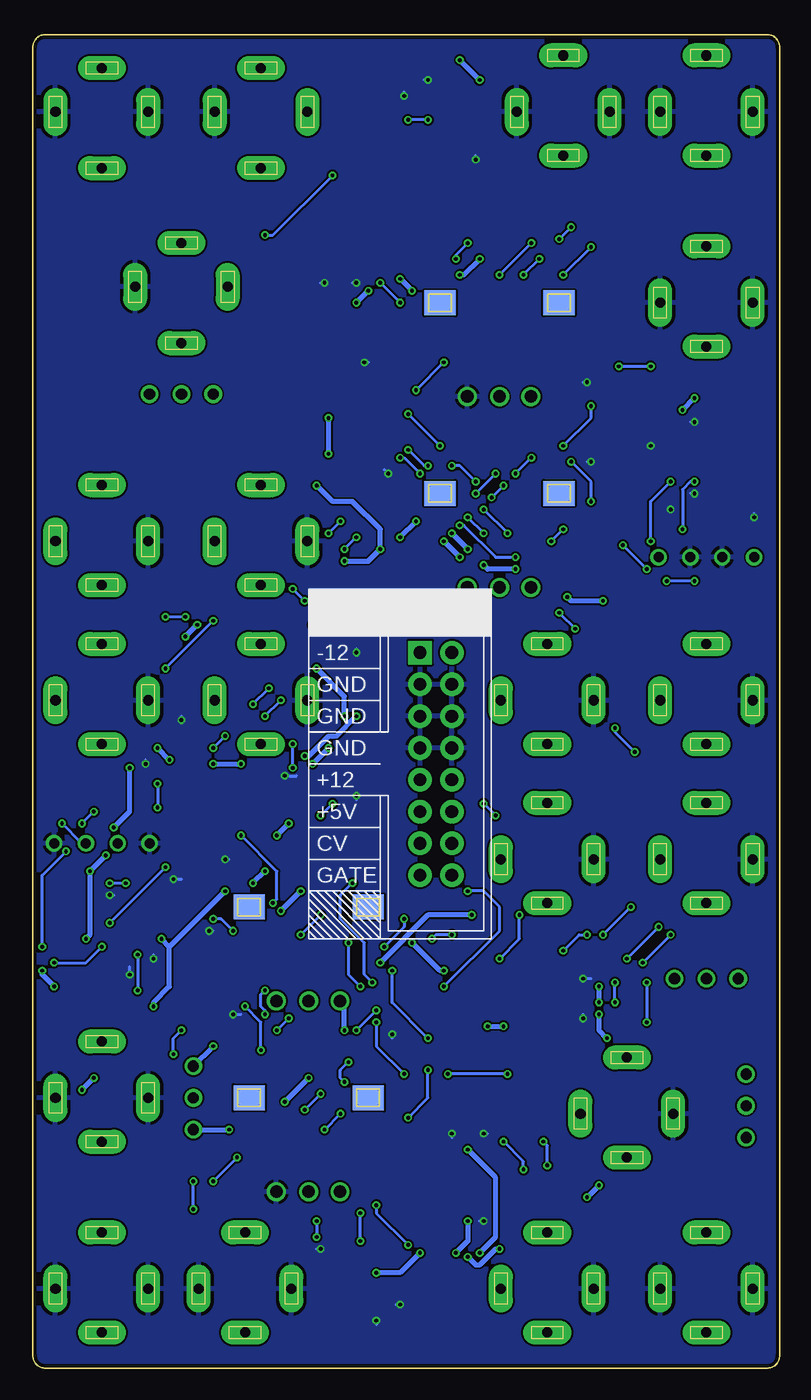
[diagram p6: board, bottom side, seen from below]

Size 59.62 x 106.5 mm. Coordinates in mm from the lower left corner, seen from the top.
Copper layers (1*16): Top 0.035mm / dielectric 1.5mm / Bottom 0.035mm
Design rules "ITEADstudio_DRC": minimum track width 6mil, minimum drill 12mil, track to track 6mil, track to pad 6mil, pad to pad 6mil, via to via 6mil, smd to smd 0mil, copper to edge 10mil, drill to drill 10mil, minimum pad ring 10mil, minimum via ring 6mil, stop-mask expansion 2mil, vias tented up to drill 100mil, thermal gap 10mil

### Footprints (pad centres in the part's own frame; a part is rotated, then mirrored left to right if it is on the bottom)
C0603 = smd 0.889 x 0.889: 1 -0.762,0; 2 0.762,0
CASE-A_3216 = smd 1.27 x 1.27: + -1.27,0; - 1.27,0
DO-214AC = smd 2.5 x 1.7: 1 -2,0; 2 2,0
SOD123 = smd 1.397 x 1.397: + -1.651,0; - 1.651,0
3MMLED = drill 0.8: + -1.27,0; - 1.27,0
SO08 = smd 0.6 x 2.2: 1 -1.905,-2.6; 2 -0.635,-2.6; 3 0.635,-2.6; 4 1.905,-2.6; 5 1.905,2.6; 6 0.635,2.6; 7 -0.635,2.6; 8 -1.905,2.6
SO14 = smd 0.6 x 2.2: 1 -3.81,-2.6; 2 -2.54,-2.6; 3 -1.27,-2.6; 4 0,-2.6; 5 1.27,-2.6; 6 2.54,-2.6; 7 3.81,-2.6; 8 3.81,2.6; 9 2.54,2.6; 10 1.27,2.6; 11 0,2.6; 12 -1.27,2.6; 13 -2.54,2.6; 14 -3.81,2.6
POWER_16_SHROUDED = drill 1.016 pad 1.88 square: 1 -8.89,-1.27 | drill 1.016 pad 1.88: 2 -8.89,1.27; 3 -6.35,-1.27; 4 -6.35,1.27; 5 -3.81,-1.27; 6 -3.81,1.27; 7 -1.27,-1.27; 8 -1.27,1.27; 9 1.27,-1.27; 10 1.27,1.27; 11 3.81,-1.27; 12 3.81,1.27; 13 6.35,-1.27; 14 6.35,1.27; 15 8.89,-1.27; 16 8.89,1.27
SOT23-BEC = smd 1 x 1.4: B -0.95,-1.1; C 0,1.1; E 0.95,-1.1
R0603 = smd 0.889 x 0.889: 1 -0.762,0; 2 0.762,0
TRIMPOT = drill 0.9: P$1 -2.54,0; P$2 0,0; P$3 2.54,0
SOIC127P620X175-16N = smd 1.981 x 0.559: 1 -2.464,4.445; 2 -2.464,3.175; 3 -2.464,1.905; 4 -2.464,0.635; 5 -2.464,-0.635; 6 -2.464,-1.905; 7 -2.464,-3.175; 8 -2.464,-4.445; 9 2.464,-4.445; 10 2.464,-3.175; 11 2.464,-1.905; 12 2.464,-0.635; 13 2.464,0.635; 14 2.464,1.905; 15 2.464,3.175; 16 2.464,4.445
SOT95P237X112-3N = smd 1.321 x 0.559: 1 -1.016,0.94; 2 -1.016,-0.94; 3 1.016,0
3.5MM-JACK-SWITCH-13MM-INPUT = drill 0.8 pad 1.93 long: RING@3 -3.7,0; SECOND@3 0,-3.5; SWITCH@3 3.7,0; TIP@3 0,4.5
3.5MM-JACK-SWITCH-13MM-OUTPUT = drill 0.8 pad 1.93 long: RING@3 -3.7,0; SECOND@3 0,-3.5; SWITCH@3 3.7,0; TIP@3 0,4.5
ALPS_POT_SQUAREHOLES = drill 1: P$1 -2.5,-7.5; P$2 0,-7.5; P$3 2.58,-7.5 | smd 2.5 x 2: P$4 -4.75,0; P$5 4.75,0 | smd 2.5 x 2 bottom: P$6 -4.75,0; P$7 4.75,0

### Placement (x,y rotation side)
C1  26.17,96.52 0 top
C2  2.99,68.58 270 top
C3  13.47,72.39 180 top
C4  35.06,102.87 270 top
C5  13.47,78.74 180 top
C6  3.31,74.93 90 top
C7  33.47,99.69 270 top
C8  2.04,78.11 90 top
C9  3.31,71.75 90 top
C10  12.84,69.85 90 top
C11  33.79,48.26 270 top
C12  33.79,54.61 270 top
C13  14.11,76.2 90 top
C14  24.58,100.97 270 top
C15  24.27,12.7 0 top
C16  17.28,27.3 180 top
C17  34.42,81.28 0 top
C18  34.42,90.81 180 top
C19  28.71,27.3 0 top
C20  24.9,22.23 0 top
C21  35.7,8.89 270 top
C22  30.61,70.48 0 top
C25  47.12,34.92 0 top
C26  57.28,38.42 270 top
C27  35.06,61.59 90 top
C28  26.8,3.81 90 top
C29  55.7,29.21 270 top
C30  26.8,6.99 90 top
C31  58.55,35.56 270 top
C32  46.49,37.15 270 top
C33  35.7,5.71 90 top
C34  44.59,30.8 270 top
C35  45.22,28.26 0 top
C36  55.7,32.07 270 top
C42  47.76,49.85 90 top
C49  50.62,46.35 270 top
C50  43.63,41.59 180 top
D1  31.25,48.26 90 top
D2  31.25,55.88 90 top
D7  30.87,13.72 270 top
D8  39.12,76.58 180 top
D_1NEG  3.31,64.77 180 top
D_1POS  8.39,64.77 180 top
D_2NEG  56.65,41.91 180 top
D_2POS  51.57,41.91 180 top
IC1  29.03,100.97 90 top
IC2  7.76,70.48 270 top
IC3  7.76,76.2 270 top
IC5  24.9,17.78 0 top
IC6  35.06,85.72 0 top
IC7  50.94,30.8 90 top
IC8  52.52,37.15 90 top
IC9  31.25,5.71 270 top
IC10  31.88,66.04 180 top
IC12  43.63,45.4 90 top
J1  27.44,48.26 270 bottom
Q1  27.76,36.2 90 top
Q2  31.88,74.61 90 top
R1  34.74,99.69 270 top
R2  23.95,94.3 0 top
R3  23.95,92.71 0 top
R4  23.63,105.09 0 top
R5  23.63,103.82 0 top
R6  16.01,76.2 270 top
R7  17.6,76.2 270 top
R8  2.04,71.75 90 top
R9  14.11,69.85 90 top
R10  5.85,60.01 0 top
R11  13.47,80.96 180 top
R12  3.31,78.11 90 top
R13  15.69,60.01 0 top
R14  5.85,47.31 0 top
R15  13.47,73.66 0 top
R16  12.84,76.2 270 top
R17  18.55,47.31 0 top
R18  3.31,61.59 0 top
R19  23.31,100.97 90 top
R20  29.66,97.16 180 top
R21  8.39,61.59 0 top
R22  31.88,60.96 0 top
R23  28.71,60.96 0 top
R24  30.61,78.74 270 top
R25  28.71,29.84 180 top
R26  28.71,28.57 180 top
R27  5.85,13.97 270 top
R28  21.09,12.7 0 top
R29  38.23,74.49 180 top
R30  17.28,29.84 0 top
R31  17.28,32.38 0 top
R32  28.07,12.06 90 top
R33  28.71,31.75 180 top
R34  31.25,90.81 180 top
R35  41.41,92.71 90 top
R36  21.73,22.23 180 top
R37  18.55,13.97 270 top
R38  28.71,33.02 180 top
R39  17.28,28.57 0 top
R40  31.25,29.84 90 top
R41  17.28,31.11 0 top
R42  13.47,27.3 0 top
R43  28.07,22.23 0 top
R44  26.8,12.06 270 top
R45  24.58,10.79 180 top
R46  35.19,74.49 180 top
R47  33.79,78.74 90 top
R48  38.23,90.81 0 top
R49  38.23,92.39 180 top
R50  56.97,29.21 270 top
R51  30.93,24.45 270 top
R52  43.31,13.65 0 top
R53  53.48,13.65 180 top
R54  54.11,60.01 180 top
R55  31.88,9.53 180 top
R56  25.54,6.99 90 top
R57  56.97,32.07 270 top
R58  58.55,38.42 270 top
R59  45.22,37.78 90 top
R60  57.28,35.56 270 top
R61  47.76,37.15 270 top
R62  41.41,60.01 180 top
R63  53.79,72.71 180 top
R64  36.97,3.81 270 top
R65  36.97,6.99 270 top
R66  41.41,72.71 180 top
R67  57.92,45.4 0 top
R68  45.85,30.8 90 top
R69  45.22,33.02 180 top
R70  57.92,46.99 0 top
R71  33.79,70.8 0 top
R72  33.79,72.07 180 top
R73  31.25,81.28 0 top
R74  54.11,92.71 90 top
R75  2.67,20.95 270 top
R76  5.85,31.11 180 top
R77  46.81,21.59 90 top
R78  47.76,77.79 180 top
R147  46.81,41.59 180 top
R148  48.71,46.67 270 top
R149  38.87,45.4 270 top
U1  23,29.21 0 top
U2  54.11,46.04 0 top
U$1  -0.5,0 0 top
U$2  5.85,100.33 0 top
U$3  18.55,53.34 0 top
U$4  5.85,53.34 0 top
U$5  5.85,40.64 0 top
U$6  5.85,85.09 0 top
U$7  22.36,85.09 0 top
U$8  22.36,69.85 0 top
U$9  54.11,6.35 0 top
U$12  5.85,6.35 0 top
U$13  17.28,100.33 0 top
U$14  12.2,20.32 0 top
U$15  54.11,100.33 180 top
U$16  47.76,86.36 180 top
U$17  18.55,40.64 0 top
U$18  18.55,6.35 0 top
U$19  41.41,100.33 180 top
U$20  54.11,53.34 0 top
U$25  42.68,6.35 0 top
U$26  41.41,53.34 0 top
U$27  54.11,66.04 0 top
U$28  54.11,21.59 0 top
U$29  37.6,36.83 0 top
U$30  41.41,66.04 0 top
U$31  37.6,21.59 0 top

### Tracks (layer width: path | path; a pad name or v marks a point on that pad's centre or on a via)
5V  (via drill 0.3)
  Top 0.381: IC12.7 39,44.77 R149.2 | R75.P$3 2.04,18.41 1.09,19.37 1.09,28.89 R76.P$3 3.31,32.38 4.58,33.66 9.66,33.66 12.84,36.83 12.84,48.9 11.56,50.16 11.56,58.74 v14.11,61.28 | v45.22,25.72 42.36,25.72 40.14,27.94 40.14,29.29 U$29.P$3 40.14,29.53 39.82,29.84 v39.82,36.51 | v16.96,61.59 16.96,61.91 18.87,63.82 v21.09,63.82 | U$8.P$3 23.63,63.66 v23.63,64.14 v24.9,65.41 | R78.P$3 46.17,77.79 47.44,79.06 48.08,79.06 49.03,78.11 49.03,77.47 48.4,76.83 48.4,76.52 45.85,73.98 40.46,73.98 v36.97,70.48 | v31.88,65.41 31.57,65.41 30.61,66.36 v30.3,66.36 | v29.03,67.63 28.71,67.31 27.12,67.31 26.49,66.67 v26.17,66.67 | v37.28,48.26 36.97,47.94 36.97,45.09 37.28,44.77 38.87,44.77 R149.2 | v36.01,49.53 36.01,59.05 36.97,60.01 36.97,62.23 v34.74,64.45 | v38.23,38.1 38.55,38.1 40.14,39.69 v40.14,42.55 | v39.19,43.5 38.87,43.81 R149.2
  Bottom 0.381: R77.P$3 v45.22,25.72 | v14.11,61.28 16.64,61.28 v16.96,61.59 | v21.09,63.82 23.31,63.82 v23.63,64.14 | v29.03,67.63 v30.3,66.36 | v24.9,65.41 v26.17,66.67 | v37.28,48.26 v36.01,49.53 | v39.82,36.51 v38.23,38.1 | v39.19,43.5 v40.14,42.55 | v36.97,70.48 35.7,69.22 34.11,69.22 31.88,66.99 v31.88,65.41 32.84,64.45 v34.74,64.45
12V  (via drill 0.3)
  Top 0.381: IC5.4 24.9,12.83 C15.2 25.03,11.87 v24.9,11.75 | C21.2 35.19,7.62 IC9.8 v32.2,7.62 | C19.1 U1.11 24.58,27.3 23.31,28.57 23.31,32.7 | C3.2 IC2.8 9.03,72.39 8.71,72.71 8.71,77.79 9.03,78.11 IC3.8 12.07,78.11 C5.2 11.56,79.88 11.56,85.09 17.6,91.12 | IC8.8 49.35,35.24 | 49.35,35.24 48.2,35.24 C25.2 | C35.2 46.62,28.89 IC7.8 v49.98,28.89 | IC12.8 42.87,41.66 C50.2 41.03,39.75 v41.09,39.69 34.42,33.02 33.79,33.02 32.2,34.61 30.93,34.61 | IC10.8 33.98,63.44 | 33.98,63.44 C27.2 35.06,62.23 36.01,62.23 36.33,61.91 36.33,60.96 v36.01,60.64 | IC1.8 26.43,98.17 | 26.43,98.17 26.93,97.66 C1.2 | 26.43,98.17 24.64,98.17 17.6,91.12 | v28.71,9.21 v25.85,9.21 25.22,9.21 v24.9,8.89 | 33.98,63.44 33.98,65.59 36.01,67.63 v36.01,73.03 | v36.01,75.88 36.01,78.74 35.38,79.38 35.38,81.09 C17.2 35.06,81.41 IC6.4 35.06,83.82 v33.79,85.09 | v49.35,34.29 49.35,35.24 | 17.6,91.12 20.14,88.58 v23.95,88.58 | v25.54,87.31 29.03,87.31 30.61,85.72 32.52,85.72 v32.84,86.04 | 16.33,33.02 16.33,33.66 16.96,34.29 22.68,34.29 23.31,33.66 23.31,32.7 | 16.33,33.02 16.33,32.38 R31.1 | 29.34,33.34 v29.34,33.97 30.3,33.97 30.93,34.61 | 29.34,33.34 29.34,33.02 R38.1 29.34,33.34 | v26.8,31.75 24.27,31.75 23.31,32.7 | v37.28,59.37 36.65,58.74 36.65,56.2 v36.97,55.88 | v34.74,52.07 34.74,49.53 C11.+ 33.06,50.26 D1.2 31.25,48.9 32.52,47.62 32.52,46.04 33.47,45.09 33.47,41.27 30.93,38.73 30.93,34.61 | 16.33,33.02 16.01,33.02 16.01,32.38 15.06,32.38 14.42,31.75 v14.42,30.48 | v14.42,28.26 v14.42,29.21 | v13.79,26.35 17.91,22.23 17.91,18.1 v14.42,14.61 | v15.38,13.65 15.38,11.11 16.96,9.53 v22.36,9.53 | v44.27,38.1 43.31,39.05 42.36,39.05 v42.05,38.73
  Bottom 0.381: v24.9,11.75 24.9,10.16 v25.85,9.21 | v28.71,9.21 30.3,7.62 v32.2,7.62 | v36.01,73.03 v36.01,75.88 | v49.98,28.89 49.98,29.21 48.71,30.48 48.71,33.66 | 48.71,33.66 v49.35,34.29 | v23.95,88.58 25.22,87.31 v25.54,87.31 | v33.79,85.09 v32.84,86.04 | v29.34,33.97 27.12,31.75 v26.8,31.75 | v37.28,59.37 v36.01,60.64 | v36.97,55.88 34.74,53.66 v34.74,52.07 | v14.42,29.21 v14.42,30.48 | v14.42,28.26 14.42,26.99 v13.79,26.35 | v15.38,13.65 v14.42,14.61 | v22.36,9.53 22.68,9.53 23.95,8.26 24.27,8.26 v24.9,8.89 | v41.09,39.69 v42.05,38.73 | 48.71,33.66 v44.27,38.1
-5V  (via drill 0.3)
  Top 0.381: R75.P$1 2.67,28.26 4.58,30.16 4.58,31.75 5.21,32.38 7.12,32.38 R76.P$1 8.71,31.11 22.68,45.09 | U$29.P$1 35.1,32.07 | 35.1,32.07 35.1,32.74 42.05,39.69 45.66,39.69 R147.1 47.57,42.16 IC12.1 IC12.2 44.27,44.77 43.95,45.09 43.95,49.21 47.76,53.02 47.76,58.1 v47.44,58.42 | U$8.P$1 19.86,61.24 21.09,60.01 21.09,56.2 20.45,55.56 20.45,51.44 21.09,50.8 21.09,46.67 22.68,45.09 | 22.68,45.09 23.95,43.81 23.95,36.83 v24.58,36.2 | v31.88,32.38 32.2,32.07 35.1,32.07 | v43.95,19.05 41.73,19.05 v39.51,21.27 | v37.6,23.18 36.33,24.45 35.38,24.45 34.11,25.72 34.11,26.35 v34.74,26.99 | v46.49,59.37 46.49,63.5 48.4,65.41 48.4,74.93 50.3,76.83 R78.P$1
  Bottom 0.381: v24.58,36.2 28.07,36.2 v31.88,32.38 | R77.P$1 v43.95,19.05 | v39.51,21.27 v37.6,23.18 | v34.74,26.99 34.74,28.97 U$29.P$1 | v46.49,59.37 v47.44,58.42
-5V_TO_5V
  Top 0.254: R149.1 39,46.04 IC12.6 42.68,46.04 43.31,45.4 43.31,43.18 43.95,42.55 45.22,42.55 46.05,41.72 R147.2
-5VIN
  Top 0.381: IC12.3 48.59,46.04 R148.2 50.3,45.91 C49.2 52.6,45.59 U2.2
-12V  (via drill 0.3)
  Top 0.381: C16.1 U1.6 v22.04,27.3 | C6.1 3.44,74.3 IC3.4 6.8,74.3 7.12,73.98 | C2.1 3.5,69.34 4.26,68.58 IC2.4 7.12,68.58 7.76,69.22 7.76,73.34 7.12,73.98 | IC6.11 35.06,90.68 C18.1 35.19,93.15 36.65,94.61 36.65,95.57 | IC12.4 46.23,48.32 46.81,48.9 47.57,48.9 C42.1 47.76,49.21 48.08,49.21 v48.71,48.58 | IC12.4 48.59,47.31 R148.1 | C26.1 57.16,39.05 IC8.4 55.12,39.63 v55.06,39.69 | IC7.4 55.57,32.7 C36.1 | v23.31,27.3 23.31,24.13 23.95,23.5 25.22,23.5 25.66,23.05 C20.2 24.9,21.46 IC5.11 v24.9,17.46 | v55.38,34.29 55.38,33.15 C36.1 | v23.95,9.21 23.95,4.76 25.54,3.17 26.68,3.17 C28.1 27.57,3.81 IC9.4 30.3,3.81 33.47,0.64 47.76,0.64 58.87,11.75 58.87,17.46 55.7,20.64 v55.7,22.23 | v30.3,87 29.03,88.27 29.03,91.76 29.66,92.39 31.25,92.39 35.06,96.2 36.33,96.2 36.65,95.89 36.65,95.57 | v29.34,86.04 29.34,82.87 28.07,81.6 28.07,73.03 29.98,71.12 29.98,70.48 C22.1 29.98,70.36 IC10.4 29.98,66.99 29.66,66.67 27.44,66.67 v26.8,66.04 | v54.74,23.18 57.92,26.35 v57.92,30.48 | v58.87,31.75 58.87,32.38 57.6,33.66 56.33,33.66 55.7,33.02 C36.1 | v25.54,64.77 26.17,64.14 26.17,60.96 27.76,59.37 29.98,59.37 30.3,59.69 32.2,59.69 32.84,59.05 32.84,58.74 33.16,58.42 33.16,57.47 32.52,56.83 32.52,56.52 31.25,55.24 D2.1 33.25,53.88 C12.- v33.79,52.07 | v23.95,102.87 23,102.87 22.36,102.23 22.36,99.69 23,99.06 23,98.42 17.6,93.03 6.17,93.03 3.31,90.17 3.31,87.95 8.39,82.87 8.39,80.01 7.12,78.74 7.12,77.79 v6.8,77.47 | v25.54,104.46 28.71,104.46 30.3,102.87 IC1.4 34.3,102.87 C4.1 35.25,103.82 37.92,103.82 39.82,101.92 39.82,98.74 36.65,95.57 | v7.76,76.52 7.76,74.61 7.12,73.98
  Top 0.381: v37.92,48.9 39.51,48.9 40.14,48.26 v43,48.26 | v45.22,48.26 45.22,47.62 45.54,47.31 IC12.4 | v49.66,49.53 49.98,49.21 50.62,49.21 v51.89,47.94 | v53.16,43.18 54.11,42.23 54.11,41.27 v53.79,40.96
  Bottom 0.381: v23.31,27.3 v22.04,27.3 | v55.38,34.29 55.06,34.61 v55.06,39.69 v53.79,40.96 | v23.95,9.21 22.68,10.48 22.68,15.24 v24.9,17.46 | v29.34,86.04 v30.3,87 | v54.74,23.18 v55.7,22.23 | v57.92,30.48 58.87,31.43 v58.87,31.75 | v25.54,64.77 v26.8,66.04 | v25.54,104.46 v23.95,102.87 | v7.76,76.52 v6.8,77.47 | v33.79,52.07 35.38,50.48 36.01,50.48 37.6,48.9 v37.92,48.9 | v45.22,48.26 v43,48.26 | v48.71,48.58 v49.66,49.53 | v51.89,47.94 51.89,44.45 v53.16,43.18
CV_IN_A
  Top 0.254: U1.16 26.8,33.66 27.12,33.97 27.12,36.05 Q1.C
CV_IN_B  (via drill 0.3)
  Top 0.254: v11.56,49.21 12.2,48.58 12.2,37.15 v11.88,36.83 | v13.15,51.12 13.15,55.24 16.33,58.42 v16.33,59.05 | v17.6,60.33 16.96,60.96 16.64,60.96 16.33,61.28 16.33,62.23 18.55,64.45 20.77,64.45 v21.09,64.77 | v25.54,67.31 25.54,71.12 25.85,71.44 v28.71,71.44 | v30.3,72.71 30.3,74.61 Q2.C | v15.38,34.61 v14.11,34.61 | v17.28,33.34 17.6,33.66 U1.1
  Bottom 0.254: v11.56,49.21 13.15,50.8 v13.15,51.12 | v17.6,60.33 v16.33,59.05 | v21.09,64.77 22.68,64.77 25.22,67.31 v25.54,67.31 | v28.71,71.44 29.98,72.71 v30.3,72.71 | v14.11,34.61 v11.88,36.83 | v15.38,34.61 16.01,34.61 v17.28,33.34
GND  (via drill 0.3)
  Top 0.254: C20.1 23.63,21.72 IC5.12 v23.63,18.73 | IC5.3 23.63,12.83 C15.1 23.5,11.87 v23.63,11.75 23.82,11.56 R45.2 | C28.2 27.31,5.08 IC9.3 v30.3,5.08 | IC9.5 v32.2,3.81 | C21.1 36.52,9.65 v36.65,9.53 | C16.2 16.33,27.3 v15.69,27.94 16.33,28.57 R39.1 | R41.1 v15.69,31.11 | R25.1 30.49,29.84 R40.1 31.25,27.62 30.93,27.3 | 30.93,27.3 C19.2 | C6.2 5.03,75.69 IC3.3 v6.8,75.56 | IC2.3 v6.8,69.85 | IC2.5 v8.71,68.58 | IC3.5 v10.29,73.66 | C3.1 v15.06,72.39 | C4.2 34.55,101.6 IC1.3 v29.98,101.6 | IC1.5 v28.07,102.87 | C18.2 33.79,90.68 IC6.12 v33.79,86.68 | IC6.10 v36.33,86.68 | IC6.3 33.79,81.41 C17.1 33.66,80.25 | 33.66,80.25 33.66,79.63 R47.2 | C42.2 v47.76,51.75 | U2.1 52.95,47.12 C49.1 v50.62,48.26 | C26.2 57.16,37.78 IC8.3 v53.48,37.78 | C36.2 55.57,31.43 IC7.3 v51.89,31.43 | IC7.5 v49.98,32.7 | C25.1 v45.54,34.92 | C35.1 v43.63,28.26 | IC8.5 v48.4,39.05 | IC12.5 v39.51,47.31 | C50.1 44.4,40.77 v44.27,40.64 | C11.- v33.79,45.72 | C12.+ v33.79,57.15 | IC5.10 v26.17,18.73 | C1.1 v24.27,96.52 | C5.1 v15.38,78.74 | C2.2 2.17,67.82 v2.04,67.94 | 30.93,27.3 v30.93,26.67 | 33.66,80.25 33.24,80.25 v33.16,80.33 | C22.2 31.38,71.31 v31.25,71.44 | C27.1 v35.06,59.69
  Bottom 0.254: v23.63,11.75 23.95,11.75 | v30.3,5.08 30.61,5.08 | v32.2,3.81 32.2,3.49 | v36.65,9.53 36.97,9.53 | v15.69,27.94 15.69,28.26 | v15.69,31.11 15.06,31.11 | v6.8,69.85 7.12,69.85 | v6.8,75.56 7.12,75.56 | v15.06,72.39 15.38,72.39 | v28.07,102.87 28.39,102.87 | v29.98,101.6 29.98,101.92 | v33.79,86.68 34.11,86.68 | v36.33,86.68 36.65,86.68 | v47.76,51.75 47.76,52.07 | v50.62,48.26 50.62,48.58 | v51.89,31.43 51.89,32.07 | v49.98,32.7 49.98,33.02 | v45.54,34.92 45.22,34.92 | v43.63,28.26 43,28.26 | v48.4,39.05 47.76,39.05 | v39.51,47.31 38.55,47.31 | v44.27,40.64 43.95,40.64 | v33.79,45.72 33.79,45.4 | v33.79,57.15 33.79,57.47 | v23.63,18.73 23.31,18.73 | v26.17,18.73 26.17,18.41 | v53.48,37.78 53.16,37.78 | v24.27,96.52 24.27,96.84 | v15.38,78.74 15.69,78.74 | v2.04,67.94 2.04,68.26 | v30.93,26.67 30.93,26.35 | v33.16,80.33 32.84,80.33 | v31.25,71.44 31.57,71.75 | v35.06,59.69 35.7,59.69
  pour Bottom: 62.3,110.05 -4.31,108.71 -3.67,-4.32 65.6,-6.54
N$1  (via drill 0.3)
  Top 0.254: v24.27,69.85 24.27,67.63 26.49,65.41 29.03,65.41 29.98,64.45 IC10.5 | v22.68,71.44 22.68,71.75 24.9,73.98 24.9,75.56 24.27,76.2 23.75,76.2 U$7.P$2
  Bottom 0.254: v22.68,71.44 v24.27,69.85
N$2
  Top 0.254: R10.1 2.04,60.01 0.77,61.28 0.77,77.6 C8.2 R12.2 4.07,78.11 IC3.1
N$3  (via drill 0.3)
  Top 0.254: R22.2 32.52,61.09 IC10.7 32.52,65.72 32.2,66.04 31.88,66.04 30.61,67.31 30.61,71.44 28.71,73.34 28.71,77.79 v29.03,78.11 | v26.8,80.33 26.8,80.64 23.31,84.14 23.31,86.36 v22.36,87.31 | v19.82,89.85 19.82,92.39 21.73,94.3 R2.1
  Bottom 0.254: v26.8,80.33 v29.03,78.11 | v19.82,89.85 v22.36,87.31
N$4  (via drill 0.3)
  Top 0.254: v15.06,89.53 5.85,89.53 U$6.TIP@3 | v17.28,87.31 19.5,87.31 19.82,87 19.82,77.79 U$7.P$1 20.14,77.47 20.45,77.15 19.5,76.2 19.5,73.66 19.82,73.34 v19.82,72.71 | v23,69.53 23,68.26 26.8,64.45 26.8,61.28 27.12,60.96 R23.1 | v21.09,71.44 v22.04,70.48
  Bottom 0.254: v17.28,87.31 v15.06,89.53 | v22.04,70.48 v23,69.53 | v19.82,72.71 v21.09,71.44
N$5
  Top 0.254: IC2.2 3.44,71.12 C9.1 R8.1 2.04,69.53 1.41,68.9 1.41,67.31 2.04,66.67 5.85,66.67 6.8,67.63 15.38,67.63 15.69,67.94 15.69,75.12 R6.2
N$6  (via drill 0.3)
  Top 0.254: U$8.P$2 22.36,69.85 27.44,74.93 27.44,80.64 23.95,84.14 23.95,86.68 v25.85,88.58 | v24.9,89.85 24.9,91.12 24.27,91.76 23.63,91.76 23.31,92.08 23.31,92.58 R3.1
  Bottom 0.254: v25.85,88.58 25.85,88.9 v24.9,89.85
N$7
  Top 0.254: R1.2 C7.2 33.35,99.06 IC1.1 31.63,98.36 R20.1 30.3,97.03 30.3,93.98 24.27,87.95 16.96,87.95 15.38,86.36 15.38,80.96 | R7.1 R6.1 16.33,77.28 16.33,80.01 15.38,80.96 | R11.1 15.38,80.96
N$8  (via drill 0.3)
  Top 0.254: C8.1 R12.1 3.82,76.83 IC3.2 7.12,76.83 7.76,77.47 7.76,78.42 9.34,80.01 v10.29,80.01 | R11.2 12.71,80.14 v12.84,80.01
  Bottom 0.254: v12.84,80.01 v10.29,80.01
N$9  (via drill 0.3)
  Top 0.254: IC2.6 11.88,69.85 12.64,69.09 C10.1 R9.1 14.93,69.09 v15.06,69.22 | v16.64,72.39 16.64,74.49 R7.2
  Bottom 0.254: v15.06,69.22 15.06,70.8 v16.64,72.39
N$10
  Top 0.254: IC10.6 31.25,61.09 R22.1 R23.2
N$11  (via drill 0.3)
  Top 0.254: R8.2 C9.2 3.44,72.39 IC2.1 6.49,72.39 7.12,71.75 7.12,71.12 v6.8,70.8 | v7.76,66.99 10.29,66.99 15.06,62.23 15.06,60.13 R13.1
  Bottom 0.254: v6.8,70.8 7.12,70.8 7.76,70.17 v7.76,66.99
N$12
  Top 0.254: U$13.TIP@3 22.61,104.83 R4.1
N$13
  Top 0.254: IC6.1 31.25,82.04 R73.1 30.49,79.63 R24.1
N$14  (via drill 0.3)
  Top 0.254: R4.2 R5.2 28.39,103.82 29.34,102.87 29.34,101.28 30.3,100.33 | 30.3,100.33 IC1.2 33.66,100.33 C7.1 R1.1 | R3.2 R2.2 27.12,94.3 28.07,95.25 v28.07,99.69 | v29.66,99.69 30.3,100.33
  Bottom 0.254: v28.07,99.69 v29.66,99.69
N$15
  Top 0.254: R13.2 16.45,59.94 U$3.TIP@3
N$16
  Top 0.254: R14.2 6.61,45.9 U$5.TIP@3
N$17
  Top 0.254: IC3.6 12.71,75.56 R16.2 | R16.2 C13.1 | R16.2 12.84,73.79 R15.1
N$18  (via drill 0.3)
  Top 0.254: IC3.7 12.71,76.83 R16.1 C13.2 14.23,76.83 v15.06,76.83 | R17.1 16.01,47.31 12.52,50.8 12.52,55.24 15.69,58.42 15.69,64.45 19.82,68.58 19.82,71.12 v17.28,73.66
  Bottom 0.254: v17.28,73.66 15.06,75.88 v15.06,76.83
N$19
  Top 0.254: R17.2 19.31,45.9 U$17.TIP@3
N$20
  Top 0.254: U$2.TIP@3 13.41,104.83 15.06,103.19 22.23,103.19 R5.1
N$21
  Top 0.254: R21.1 7.63,62.74 D_1POS.+
N$22
  Top 0.254: R10.2 6.61,58.6 U$4.TIP@3
N$23
  Top 0.254: R18.1 2.55,64.26 D_1NEG.-
N$24  (via drill 0.3)
  Top 0.254: R18.2 5.53,61.59 v6.8,62.87 | v9.03,62.87 9.03,61.72 R21.2 10.29,61.59 10.29,63.18 10.61,63.5 v10.61,63.82 | IC1.7 24.71,100.33 C14.2 | C14.2 R19.1 | v12.52,65.72 13.79,66.99 v17.28,66.99 | v18.23,66.04 18.23,66.36 20.45,68.58 20.45,73.34 20.14,73.66 20.14,76.2 21.09,77.15 21.09,78.11 20.45,78.74 v20.45,87.31 | v17.6,90.17 v19.18,88.58 | v16.64,91.12 23.63,98.11 23.63,100.01 23.95,100.33 24.58,100.33 C14.2
  Bottom 0.254: v6.8,62.87 v9.03,62.87 | v12.52,65.72 v10.61,63.82 | v18.23,66.04 v17.28,66.99 | v19.18,88.58 v20.45,87.31 | v16.64,91.12 v17.6,90.17
N$25
  Top 0.254: R19.2 C14.1 24.71,101.6 IC1.6 27.76,101.6 28.9,100.46 R20.2
N$26
  Top 0.254: R37.2 U$18.TIP@3
N$27  (via drill 0.3)
  Top 0.254: R36.2 21.09,22.1 IC5.14 18.87,18.16 v18.87,18.1 | R37.1 v18.55,16.19
  Bottom 0.254: v18.55,16.19 18.55,17.78 v18.87,18.1
N$28
  Top 0.381: J1.10 J1.9 30.52,46.99 D1.1
N$29
  Top 0.254: U1.2 R31.2
N$30
  Top 0.254: R38.2 27.44,33.02 26.8,32.38 U1.15
N$31
  Top 0.254: U$19.TIP@3 R35.2
N$32  (via drill 0.3)
  Top 0.254: IC6.14 31.25,90.04 R34.2 34.93,95.25 v35.7,95.25 | R35.1 41.41,90.81 v41.09,90.49
  Bottom 0.254: v41.09,90.49 40.46,90.49 v35.7,95.25
N$33  (via drill 0.3)
  Top 0.254: R75.P$2 3.31,20.95 5.21,22.86 5.21,27.94 6.17,28.89 12.84,28.89 v13.15,29.21 | v13.15,30.8 13.15,31.43 16.64,34.92 25.85,34.92 v26.17,34.61 | v27.76,34.29 28.39,34.29 28.71,33.97 28.71,32.07 29.03,31.75 R33.1
  Bottom 0.254: v13.15,29.21 v13.15,30.8 | v26.17,34.61 27.44,34.61 v27.76,34.29
N$34
  Top 0.254: R77.P$2 46.49,21.59 45.54,20.64 45.54,16.83 43.63,14.92 42.05,14.92 41.41,14.29 41.41,13.34 39.19,11.11 32.52,11.11 32.2,10.79 28.58,10.79 R32.1
N$35
  Top 0.254: R30.1 7.12,29.84 R76.P$2
N$36
  Top 0.254: R78.P$2 47.76,76.83 45.54,74.61 39.12,74.61 R29.1
N$37
  Top 0.254: R27.2 U$12.TIP@3
N$38
  Top 0.254: U$15.TIP@3 R74.2
N$39
  Top 0.254: R28.2 22.36,13.21 IC5.2 22.36,16.51 21.73,17.14 21.09,17.14 20.45,17.14 17.91,17.14 14.11,13.34 13.15,13.34 11.76,14.73 R27.1
N$41  (via drill 0.3)
  Top 0.254: R26.1 29.34,28.57 28.71,27.94 28.71,23.5 28.07,22.86 28.07,18.41 27.76,18.1 26.8,18.1 25.54,16.83 24.58,16.83 23.95,17.46 22.68,17.46 v22.04,18.1 | 20.45,12.7 R28.1 21.09,13.46 IC5.1 21.09,15.24 v20.45,15.88
  Bottom 0.254: v20.45,15.88 20.45,16.51 v22.04,18.1
N$43
  Top 0.254: U1.13 R25.2 R26.2
N$44  (via drill 0.3)
  Top 0.254: R39.2 18.87,28.57 19.18,28.89 19.18,29.53 19.5,29.84 U1.4 22.36,29.84 22.68,30.16 22.68,32.38 v22.36,32.7 | v26.17,72.07 v28.07,72.07 | v24.27,70.8 23.63,70.17 v23.63,68.58 | v21.73,66.67 21.73,63.18 21.09,62.55 21.09,61.91 23.63,59.37 v23.63,45.09 | v22.68,44.13 20.14,41.59 20.14,39.05 20.77,38.42 v20.77,36.2 | R24.2 30.61,76.2 29.66,75.25 v29.66,73.34
  Bottom 0.254: v29.66,73.34 28.39,72.07 v28.07,72.07 | v26.17,72.07 25.54,72.07 v24.27,70.8 | v21.73,66.67 v23.63,68.58 | v22.68,44.13 v23.63,45.09 | v20.77,36.2 20.77,34.29 v22.36,32.7
N$45
  Top 0.254: U1.14 27.31,31.11 | 27.31,31.11 R33.2 | R40.2 30.49,30.61 30.3,30.8 27.63,30.8 27.31,31.11
N$46
  Top 0.254: U1.3 R41.2 R30.2
N$47
  Top 0.254: R49.1 39.82,92.39 40.14,92.08 40.14,85.41 43.95,81.6 47.5,81.6 U$16.TIP@3
N$48
  Top 0.254: U$14.TIP@3 12.2,26.8 R42.1
N$49
  Top 0.254: R73.2 32.52,81.79 IC6.2 32.52,84.77 33.47,85.72 35.06,85.72 35.7,86.36 35.7,89.85 36.01,90.17 36.01,92.71 36.97,93.66 37.6,93.66 38.55,94.61 38.55,96.2 39.82,97.47 46.81,97.47 52.2,92.08 53.98,92.08 R74.1
N$50  (via drill 0.3)
  Top 0.254: IC5.9 27.44,22.1 R43.1 27.12,22.42 27.12,22.86 v26.49,23.5 | R42.2 14.23,26.86 17.6,23.5 v21.73,23.5
  Bottom 0.254: v21.73,23.5 v26.49,23.5
N$51
  Top 0.254: R43.2 28.71,22.1 IC5.8 28.71,18.1 28.07,17.46 26.8,17.46 26.17,16.83 IC5.5
N$52
  Top 0.254: IC5.6 27.44,13.46 | 27.44,13.46 R32.2 30.11,12.83 D7.- | 27.44,13.46 R44.1
N$53  (via drill 0.3)
  Top 0.254: R56.2 C30.2 28.52,7.75 IC9.1 29.66,8.63 v29.66,9.84 | R54.1 54.87,60.52 54.43,60.96 49.98,60.96 v49.03,60.01 | v47.44,60.01 47.44,59.37 36.33,48.26 36.33,44.77 34.74,43.18 34.74,34.29 v34.42,33.97 | v33.47,30.48 33.47,28.89 v32.2,27.62 | v29.98,23.5 29.98,20.64 32.2,18.41 v32.2,13.02
  Bottom 0.254: v49.03,60.01 v47.44,60.01 | v34.42,33.97 34.42,31.43 v33.47,30.48 | v32.2,27.62 32.2,25.72 v29.98,23.5 | v32.2,13.02 32.2,12.38 v29.66,9.84
N$54
  Top 0.254: U$29.P$2 37.6,28.89 36.65,27.94 33.66,27.94 R51.1
N$55  (via drill 0.3)
  Top 0.254: IC5.7 28.9,15.37 D7.+ 30.93,15.24 31.57,15.24 31.57,18.41 29.98,20 v29.66,20 | v28.07,23.81 v28.07,26.35 | v30.93,31.75 30.93,33.02 v31.57,33.66 | 29.34,35.24 Q1.B 29.49,35.39 v29.98,35.88
  Bottom 0.254: v30.93,31.75 30.93,29.21 v28.07,26.35 | v28.07,23.81 28.07,21.59 v29.66,20 | v31.57,33.66 29.98,35.24 v29.98,35.88
N$56  (via drill 0.3)
  Top 0.254: R44.2 25.85,11.3 R45.1 25.22,10.79 24.27,9.84 23.63,9.84 22.68,8.89 4.26,8.89 0.45,12.7 0.45,31.75 3.31,34.61 v8.71,34.61 | v10.93,32.38 13.79,35.24 16.33,35.24 16.64,35.56 24.9,35.56 25.54,36.2 25.54,36.83 25.85,37.15 29.03,37.15 Q1.E
  Bottom 0.254: v10.93,32.38 v8.71,34.61
N$57
  Top 0.254: IC6.6 37.6,76.71 D8.- R29.2 R46.1
N$58
  Top 0.254: IC6.7 38.87,78.49 D8.+ 40.77,76.52 39.51,76.52 38.23,75.25 38.23,73.98 37.92,73.66 Q2.B
N$59
  Top 0.254: R47.1 33.79,76.37 Q2.E 33.35,75.56 R46.2
N$60
  Top 0.254: R48.2 38.87,90.68 IC6.8 38.87,86.04 37.92,85.09 36.97,85.09 36.33,84.45 IC6.5
N$62
  Top 0.254: IC6.9 37.6,90.68 R48.1 R49.2
N$63
  Top 0.254: U$25.TIP@3 42.68,13.84 R52.1
N$64
  Top 0.381: J1.2 J1.1 30.52,57.15 D2.2
N$65  (via drill 0.3)
  Top 0.254: IC7.2 55.51,30.16 C29.1 R50.1 R57.2 58.24,31.3 58.55,30.99 58.55,26.04 51.25,18.73 51.25,15.88 52.71,14.41 R53.2 44.9,13.65 | R52.2 44.9,13.65 | R51.2 34.87,23.69 v36.65,21.91 | v37.92,20.64 41.41,17.14 43,17.14 v43.31,16.83 | v45.22,14.92 45.22,13.97 44.9,13.65
  Bottom 0.254: v36.65,21.91 v37.92,20.64 | v43.31,16.83 v45.22,14.92
N$66
  Top 0.254: R54.2 53.35,58.6 U$20.TIP@3
N$67  (via drill 0.3)
  Top 0.254: R50.2 C29.2 55.25,28.89 IC7.1 51.89,28.89 51.25,29.53 v51.25,30.16 | R58.1 58.55,38.73 58.24,38.42 53.79,38.42 v53.48,38.73 | v52.2,38.73 52.2,34.92 51.25,33.97 | 51.25,33.97 v51.25,33.02 | 51.25,33.97 50.94,33.66 47.12,33.66 46.49,33.02 R69.1 44.59,34.42 | R59.1 45.22,36.83 44.59,36.2 44.59,34.42 | R55.1 32.84,9.53 v33.47,10.16 | v33.47,12.38 33.47,17.14 41.41,25.08 v41.41,25.4 | v42.68,28.89 42.68,33.02 43.63,33.97 44.14,33.97 44.59,34.42
  Bottom 0.254: v53.48,38.73 v52.2,38.73 | v51.25,33.02 v51.25,30.16 | v33.47,10.16 v33.47,12.38 | v41.41,25.4 41.41,27.62 v42.68,28.89
N$68
  Top 0.254: R56.1 C30.1 28.52,6.22 IC9.2 30.3,6.35 31.12,7.18 R55.2
N$69
  Top 0.254: R53.1 54.24,10.98 U$9.TIP@3
N$70  (via drill 0.3)
  Top 0.254: U$28.TIP@3 49.72,26.09 49.66,26.04 46.81,26.04 | U$31.P$1 36.17,12.7 38.23,12.7 38.87,13.34 38.87,14.92 39.82,15.88 43.63,15.88 44.9,17.14 44.9,24.13 46.81,26.04 | v35.06,67.63 35.38,67.94 35.38,71.44 34.74,72.07 R72.1 34.42,72.07 | v36.01,66.67 35.38,66.04 35.38,65.41 38.55,62.23 v38.87,62.23 | v37.92,61.28 38.55,60.64 38.55,55.88 39.82,54.61 v39.82,53.34 | v41.09,52.07 40.77,52.07 38.87,50.16 v38.87,49.85 | v38.87,47.94 37.92,46.99 37.92,45.72 38.23,45.4 42.36,45.4 42.68,45.09 42.68,42.86 v43,42.55 | v40.46,37.15 40.46,31.11 41.09,30.48 v41.09,30.16 | v41.09,28.26 41.09,27.94 42.68,26.35 46.49,26.35 46.81,26.04
  Bottom 0.254: v36.01,66.67 v35.06,67.63 | v37.92,61.28 v38.87,62.23 | v41.09,52.07 v39.82,53.34 | v38.87,47.94 v38.87,49.85 | v43,42.55 40.14,39.69 40.14,37.47 v40.46,37.15 | v41.09,30.16 41.41,29.84 41.41,28.89 41.09,28.57 v41.09,28.26
N$71
  Top 0.254: IC8.2 57.09,36.51 R60.1 C31.1 R58.2
N$72
  Top 0.254: IC8.6 47.89,37.78 R61.1 C32.1 R59.2
N$73  (via drill 0.3)
  Top 0.254: IC8.1 56.84,35.24 R60.2 C31.2 58.55,34.92 58.87,34.92 v58.87,33.66 | R62.1 44.9,60.01 v45.22,59.69 | v49.03,55.88 51.57,55.88 56.33,51.12 56.33,48.9 54.11,46.67 54.11,45.4 54.74,44.77 v54.74,44.45 | v55.7,43.5 56.97,42.23 v56.97,41.27
  Bottom 0.254: v49.03,55.88 v45.22,59.69 | v55.7,43.5 v54.74,44.45 | v56.97,41.27 58.87,39.37 v58.87,33.66
N$75
  Top 0.254: R62.2 40.65,58.6 U$26.TIP@3
N$76
  Top 0.254: R63.2 53.03,71.62 U$27.TIP@3
N$77
  Top 0.254: IC9.6 35.57,5.08 C33.1 36.58,4.95 R64.1 R65.2
N$78  (via drill 0.3)
  Top 0.254: IC9.7 35.57,6.35 C33.2 R65.1 36.97,7.94 37.28,8.26 37.28,10.48 v36.97,10.48 | R66.1 42.68,72.71 47.76,67.63 47.76,65.72 45.85,63.82 45.85,58.42 35.7,48.26 v35.7,45.09 | v36.97,11.75 33.16,11.75 32.84,12.06 32.84,17.14 40.77,25.08 40.77,26.35 v40.14,26.99 | v39.19,27.94 39.19,28.57 38.87,28.89 38.87,33.97 v38.23,34.61 | v36.65,36.2 35.38,37.47 35.38,43.18 36.33,44.13 v36.65,44.13
  Bottom 0.254: v36.97,11.75 v36.97,10.48 | v39.19,27.94 v40.14,26.99 | v36.65,36.2 v38.23,34.61 | v35.7,45.09 v36.65,44.13
N$79
  Top 0.254: R66.2 40.65,71.3 U$30.TIP@3
N$80  (via drill 0.3)
  Top 0.254: v57.28,43.5 57.28,45.28 R67.1
  Bottom 0.254: D_2NEG.- 55.7,41.91 v57.28,43.5
N$81
  Top 0.254: C34.2 R68.1 45.98,30.16 IC7.7 50.3,30.16 50.94,30.8 50.94,31.75 51.89,32.7 51.89,33.66 52.84,34.61 52.84,39.05 54.43,40.64 58.55,40.64 58.87,40.96 58.87,45.21 R67.2 R70.2
N$82
  Top 0.254: IC7.6 45.98,31.43 R68.2 C34.1 44.59,32.89 R69.2
N$83
  Top 0.254: R70.1 56.33,46.16 56.33,45.09 54.74,43.5 54.43,43.5 53.79,44.13 52.52,44.13 51.89,43.5 51.89,42.86 D_2POS.+
N$84  (via drill 0.3)
  Top 0.254: IC10.3 31.25,67.31 31.88,66.67 32.2,66.67 33.16,65.72 33.16,61.91 33.47,61.59 33.47,59.05 35.38,57.15 35.38,48.58 35.06,48.26 35.06,44.13 34.11,43.18 v34.11,38.73 | v32.52,30.8 32.84,30.48 32.84,28.89 32.52,28.57 v32.2,28.57 | v33.79,26.99 33.47,26.67 33.47,25.4 v34.42,24.45 | v34.74,22.86 35.06,22.54 v35.06,20.32 | v36.33,19.05 36.33,16.19 37.6,14.92 U$31.P$2
  Bottom 0.254: v32.52,30.8 33.16,31.43 33.16,33.97 35.06,35.88 35.06,37.78 v34.11,38.73 | v33.79,26.99 v32.2,28.57 | v34.42,24.45 35.06,23.81 35.06,23.18 v34.74,22.86 | v36.33,19.05 v35.06,20.32
N$85  (via drill 0.3)
  Top 0.254: R71.2 33.79,70.04 IC10.1 v33.79,66.36 | v34.74,65.41 39.19,60.96 39.19,55.88 v40.77,54.29 | v42.05,53.02 44.27,50.8 v44.27,50.48 | v45.22,49.53 44.59,48.9 44.59,45.72 44.9,45.4 47.44,45.4 48.4,44.45 48.4,40.96 49.03,40.32 v49.03,40.01 | v53.48,35.56 53.48,34.29 v54.11,33.66 | v57.92,32.38 57.28,33.02 56.97,33.02 R57.1
  Bottom 0.254: v34.74,65.41 v33.79,66.36 | v42.05,53.02 v40.77,54.29 | v45.22,49.53 v44.27,50.48 | v53.48,35.56 v49.03,40.01 | v54.11,33.66 55.38,32.38 v57.92,32.38
N$86
  Top 0.254: IC10.2 32.52,70.29 R71.1 R72.2
OUTPUT1_SUM_TO_VCA1  (via drill 0.3)
  Top 0.254: 13.47,70.61 C10.2 12.33,71.12 IC2.7 9.03,71.12 v8.71,70.8 | 13.47,70.61 R9.2 | R15.2 14.11,73.66 13.47,73.03 13.47,70.61 | v10.29,66.04 11.25,65.09 11.25,63.5 10.93,63.18 10.93,58.42 2.67,50.16 2.67,49.21 4.58,47.31 R14.1 4.26,47.31 2.67,45.72 2.67,44.13 9.34,37.47 9.34,35.56 v9.66,35.24 | v12.2,32.7 12.2,32.38 v10.61,30.8 | v10.61,27.62 10.61,26.99 9.34,25.72 9.34,23.5 10.93,21.91 14.31,21.91 U$14.SWITCH@3
  Bottom 0.254: v10.29,66.04 10.29,69.22 v8.71,70.8 | v9.66,35.24 v12.2,32.7 | v10.61,30.8 v10.61,27.62
OUTPUT2_SUM_TO_VCA2  (via drill 0.3)
  Top 0.254: U$16.SWITCH@3 46.81,86.36 54.43,78.74 54.43,72.83 R63.1 55.7,72.71 56.97,71.44 56.97,68.9 48.4,60.33 48.4,52.39 48.71,52.07 48.71,49.53 49.66,48.58 v49.66,46.67 | R64.2 39.38,3.05 46.81,10.48 v46.81,12.7 | v46.81,14.92 46.81,16.19 48.4,17.78 v48.4,25.08 | v47.76,26.99 42.68,26.99 41.73,27.94 41.73,33.02 v43.63,34.92 | v45.22,35.88 45.98,35.88 C32.2 R61.2 47.89,36.51 IC8.7 51.25,36.51 51.57,36.83 51.57,39.69 50.94,40.32 49.66,40.32 49.03,40.96 49.03,43.5 49.66,44.13 v49.66,44.77
  Bottom 0.254: v46.81,12.7 v46.81,14.92 | v48.4,25.08 48.4,26.35 v47.76,26.99 | v43.63,34.92 44.59,35.88 v45.22,35.88 | v49.66,46.67 v49.66,44.77
TRANS_OUT_A
  Top 0.254: IC5.13 22.36,22.1 R36.1 22.68,22.42 22.68,27.94 22.04,28.57 U1.5 19.82,28.57
TRANS_OUT_B  (via drill 0.3)
  Top 0.254: R34.1 32.52,90.3 IC6.13 32.52,86.68 32.2,86.36 v31.88,86.68 | v23.63,66.67 23,66.04 23,63.18 23.63,62.55 23.63,61.91 24.27,61.28 24.27,44.45 24.58,44.13 24.58,38.42 v24.9,38.1 | v26.8,30.48 24.27,30.48 23.95,30.16 23.95,28.89 24.27,28.57 U1.12 | v24.9,67.94 24.9,71.75 26.8,73.66 v27.12,73.66 | v29.66,76.2 29.66,79.38 28.71,80.33 28.71,81.28 29.98,82.55 29.98,84.77 v30.3,85.09
  Bottom 0.254: v23.63,66.67 v24.9,67.94 | v26.8,30.48 22.36,34.92 22.36,36.83 23.63,38.1 v24.9,38.1 | v29.66,76.2 v27.12,73.66 | v31.88,86.68 v30.3,85.09